# EasyEDA Pro project 赛博沙漏-细砂版（完全开源）.eprj

# Schematic 7219
Create Date: 2023-11-12; Page Name: P1; Project Name: 7219; Schematic Name: 7219; Update Date: 2023-11-12; Company: 嘉立创EDA; Page Size: A4; Version: V1.0
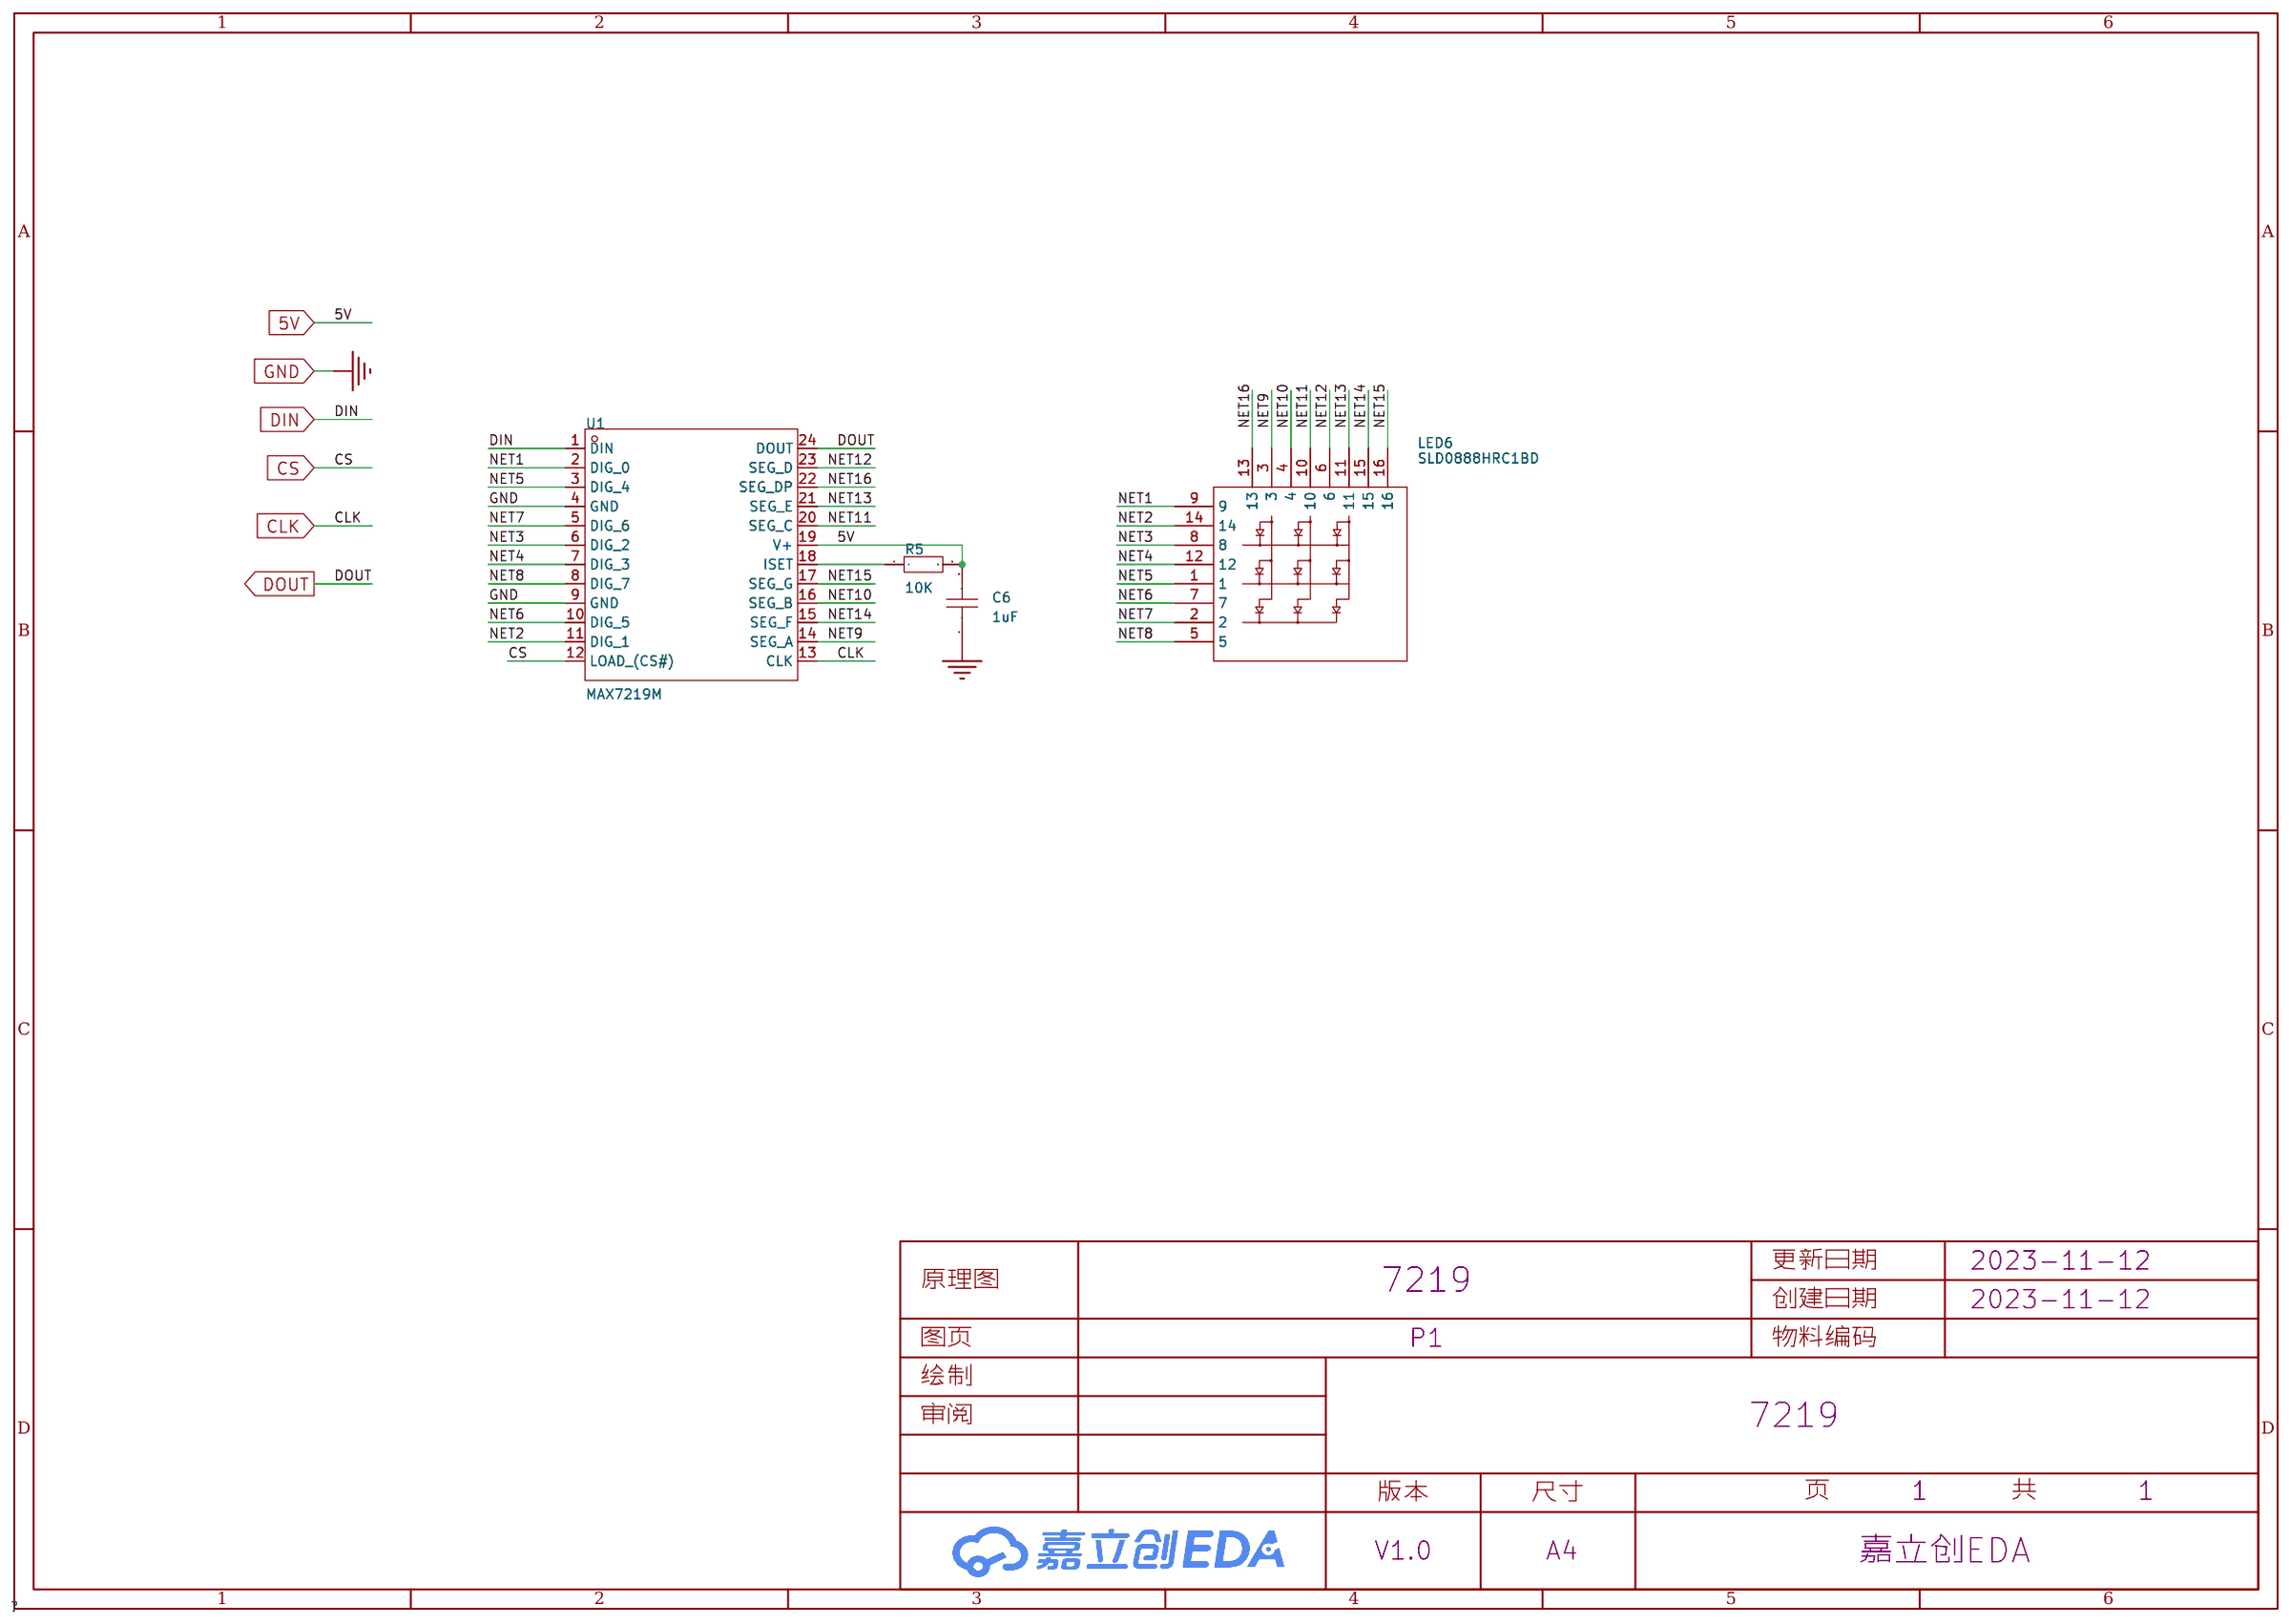
[diagram p0: schematic sheet]

## Parts
C6  1uF  [C0603]
LED6  SLD0888HRC1BD  [LED-SEG-TH_16P-L20.0-W20.0-P2.50-S15.0-BL-1]
R5  10K  [R0603]
U1  MAX7219M  [SOP-24_L15.2-W7.8-P1.27-LS10.6-BL]

## Library data of the parts
C6 = CAP_0603: Supplier Footprint: 0603
LED6 = SLD0888HRC1BD: 位数:8x8;发光颜色:红色;极性:共阴;; LCSC Part Name: 8*8mm,红光,共阴LED点阵数码管,插件; Supplier Part: C225985; Manufacturer: SUNLIGHT(光华); Supplier Footprint: 插件; JLCPCB Part Class: 扩展库; Datasheet: https://atta.szlcsc.com/upload/public/pdf/source/20180608/C225985_43E6E19EA73F5865773790A87A7F1678.pdf; Supplier: LCSC; Dot Matrix Number: 8x8; Emitting Color: 红色; Polarity: 共阴
R5 = Res_0603: Supplier Footprint: 0603
U1 = MAX7219M: Supplier Part: C492110; Manufacturer: HGSEMI(华冠); Supplier Footprint: SOP-24-300mil; JLCPCB Part Class: Extended Part; Datasheet: https://atta.szlcsc.com/upload/public/pdf/source/20200309/C492110_83BE5F1043010F478F6EFCE5853BF374.pdf; Supplier: LCSC

## Nets
5V: C6.2 R5.2 U1.19(V+)
GND: C6.1 U1.4(GND) U1.9(GND)
CLK: U1.13(CLK)
CS: U1.12(LOAD (CS#))
DIN: U1.1(DIN)
DOUT: U1.24(DOUT)
NET1: LED6.9 U1.2(DIG 0)
NET2: LED6.14 U1.11(DIG 1)
NET3: LED6.8 U1.6(DIG 2)
NET4: LED6.12 U1.7(DIG 3)
NET5: LED6.1 U1.3(DIG 4)
NET6: LED6.7 U1.10(DIG 5)
NET7: LED6.2 U1.5(DIG 6)
NET8: LED6.5 U1.8(DIG 7)
NET9: LED6.3 U1.14(SEG A)
NET10: LED6.4 U1.16(SEG B)
NET11: LED6.10 U1.20(SEG C)
NET12: LED6.6 U1.23(SEG D)
NET13: LED6.11 U1.21(SEG E)
NET14: LED6.15 U1.15(SEG F)
NET15: LED6.16 U1.17(SEG G)
NET16: LED6.13 U1.22(SEG DP)
$1N310: R5.1 U1.18(ISET)

# Schematic Schematic1
Create Date: 2023-11-27; Page Name: P1; Project Name: 赛博沙漏-细砂版; Schematic Name: Schematic1; Update Date: 2023-11-27; Company: 嘉立创EDA; Page Size: A4; Version: V1.0
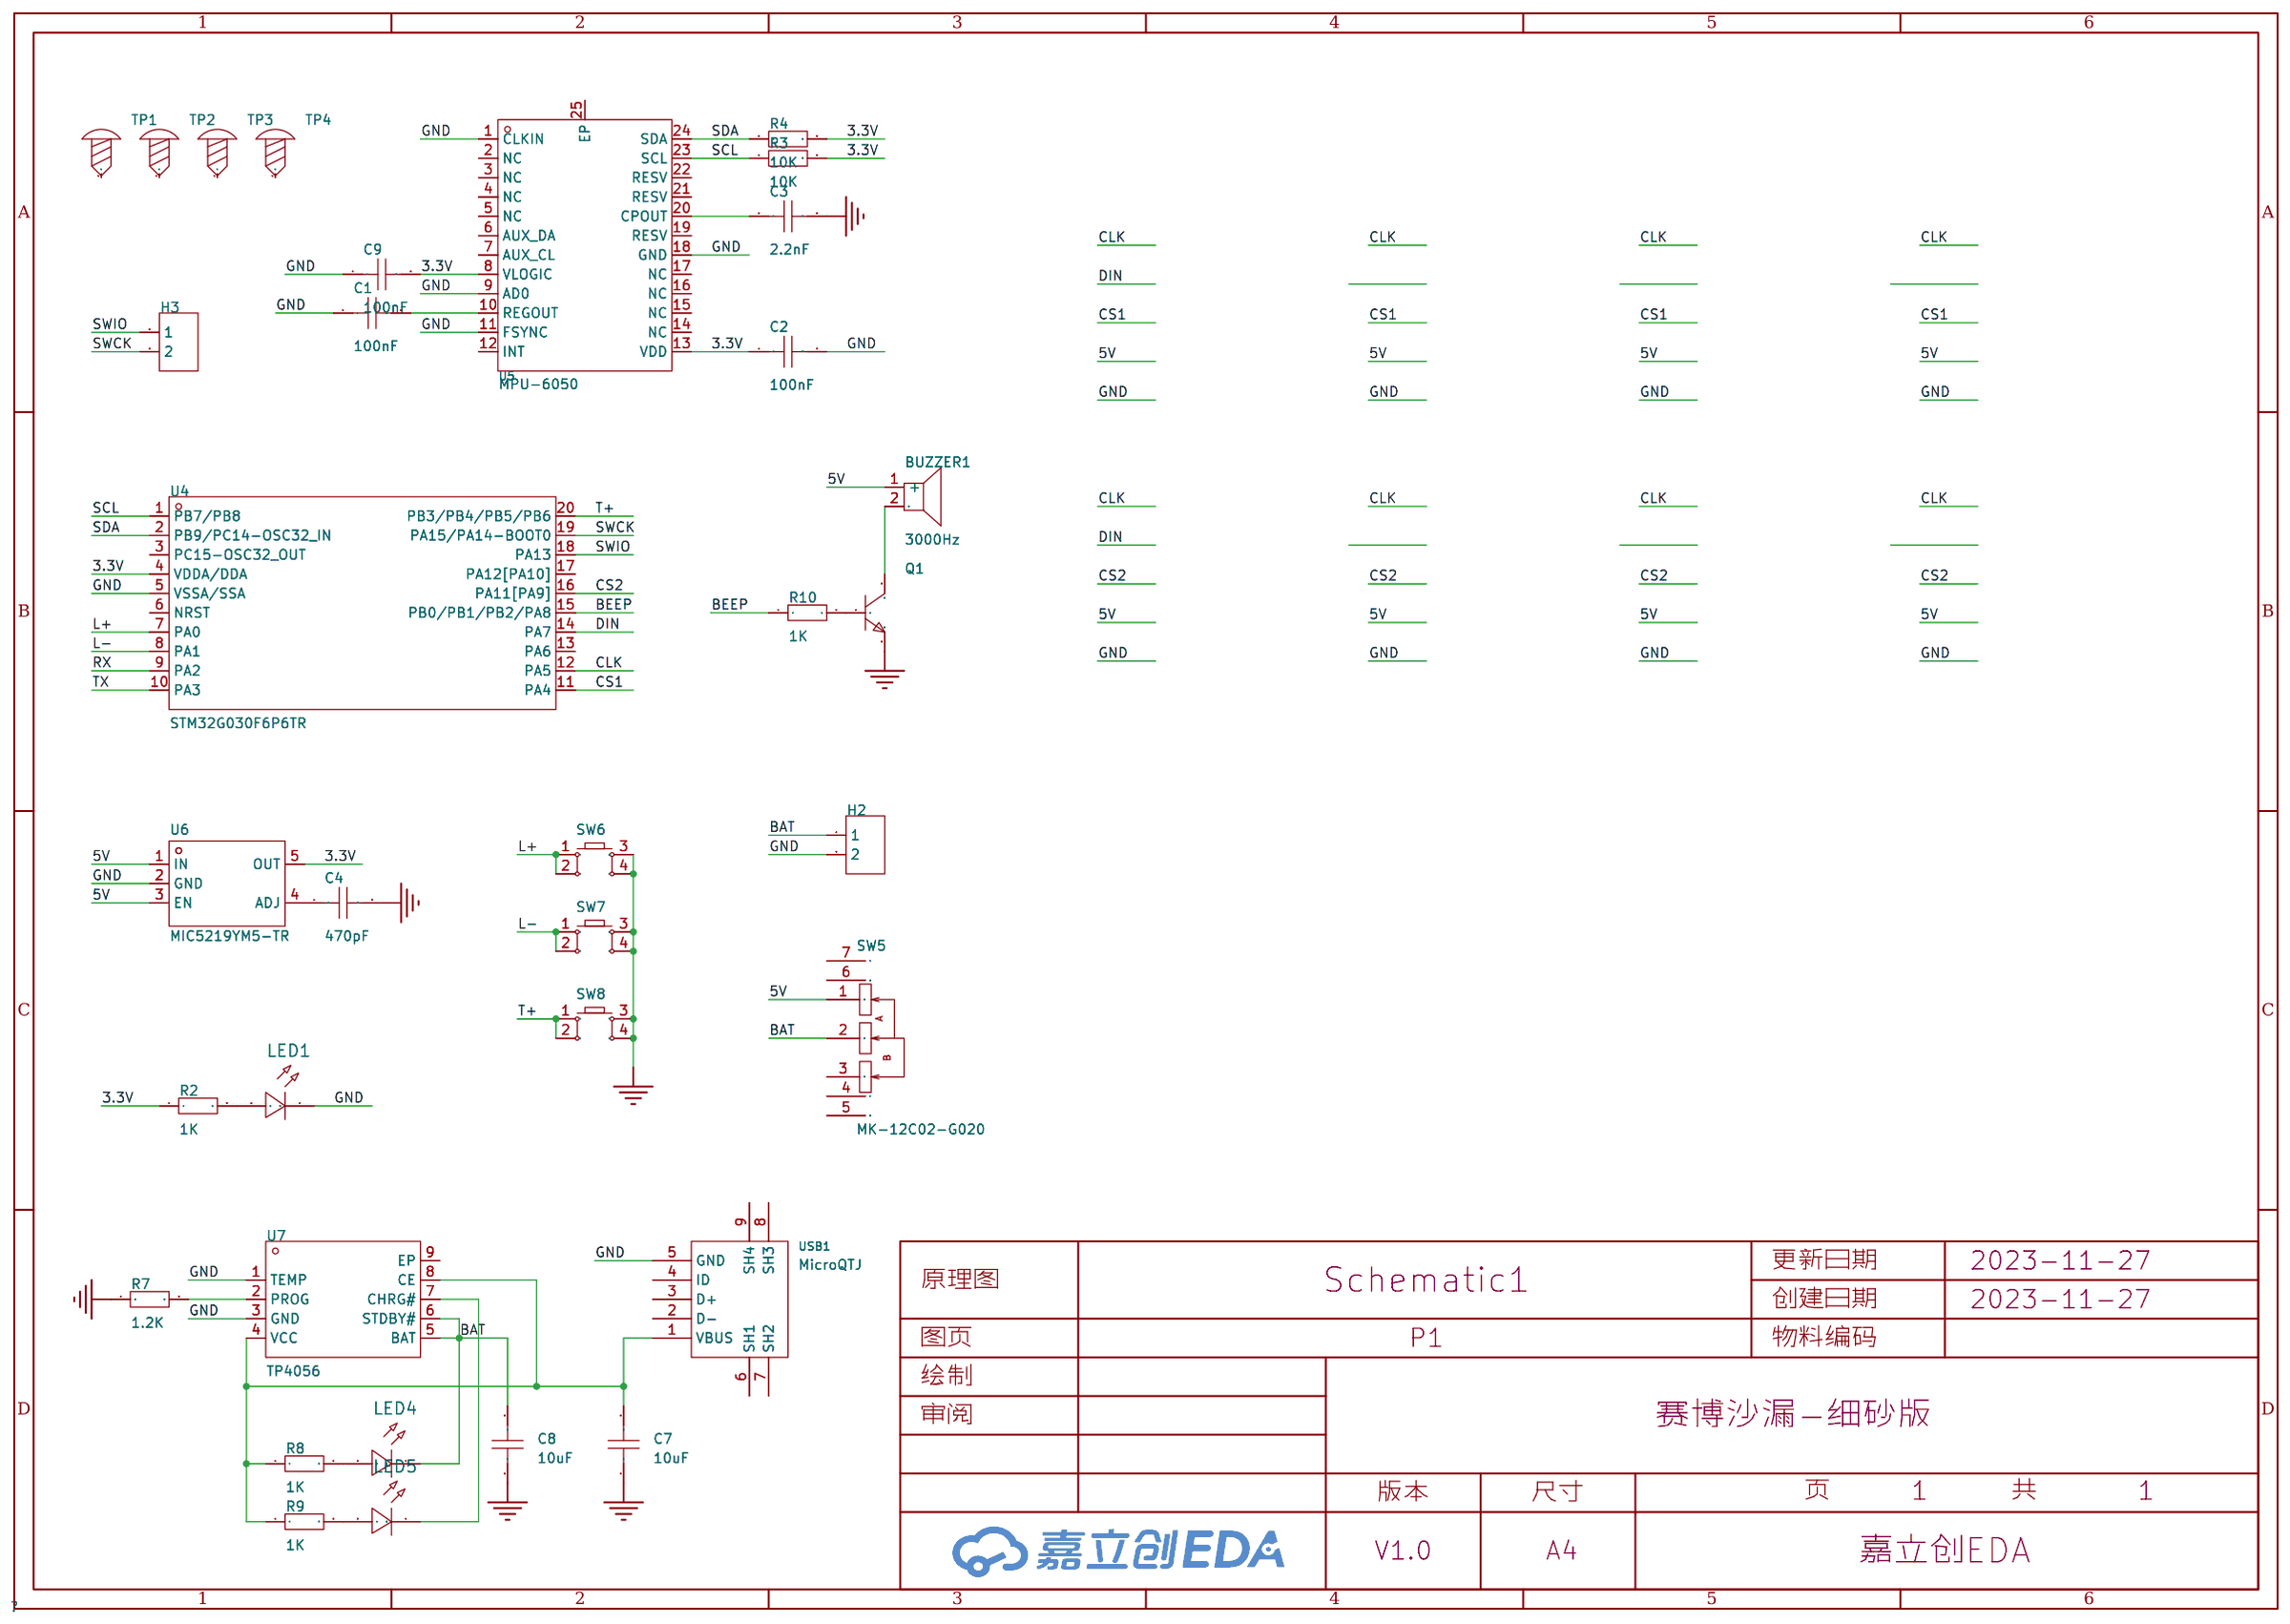
[diagram p1: schematic sheet]

## Parts
BUZZER1  3000Hz  [BUZ-TH_BD9.6-P5.00-D0.7-FD]
C1  100nF  [C0603]
C2  100nF  [C0603]
C3  2.2nF  [C0603]
C4  470pF  [C0603]
C7  10uF  [C0603]
C8  10uF  [C0603]
C9  100nF  [C0603]
CBB1  -
CBB2  -
CBB3  -
CBB4  -
CBB5  -
CBB6  -
CBB7  -
CBB8  -
H2  -  [HDR-TH_2P-P2.54-V-F]
H3  -  [HDR-TH_2P-P2.54-V-F]
LED1  -  [LED_0603]
LED4  -  [LED_0603]
LED5  -  [LED_0603]
Q1  -  [S8050_SOT-23]
R2  1K  [R0603]
R3  10K  [R0603]
R4  10K  [R0603]
R7  1.2K  [R0603]
R8  1K  [R0603]
R9  1K  [R0603]
R10  1K  [R0603]
SW5  MK-12C02-G020  [SW-SMD_MK-12C02-G020]
SW6  -  [SW-SMD_4P-L6.0-W6.0-P4.50-LS9.0-2]
SW7  -  [SW-SMD_4P-L6.0-W6.0-P4.50-LS9.0-2]
SW8  -  [SW-SMD_4P-L6.0-W6.0-P4.50-LS9.0-2]
TP1  -  [M3螺丝]
TP2  -  [M3螺丝]
TP3  -  [M3螺丝]
TP4  -  [M3螺丝]
U4  STM32G030F6P6TR  [TSSOP-20_L6.5-W4.4-P0.65-LS6.4-BL]
U5  MPU-6050  [QFN-24_L4.0-W4.0-P0.50-BL-EP2.7]
U6  MIC5219YM5-TR  [SOT-23-5_L3.0-W1.7-P0.95-LS2.8-TL]
U7  TP4056  [ESOP-8_L4.9-W3.9-P1.27-LS6.0-BL-EP]
USB1  MicroQTJ  [MICRO-USB-SMD_MICROQTJ]

## Library data of the parts
BUZZER1 = HNB09A05: 驱动方式:有源(内含驱动线路);构造类型:电磁式;额定电压:5V;工作电压:4V~8V;频率:3000Hz;声压(SPL):85dB@5V,10cm;直径(φD):9mm;高度:5.7mm;; Supplier Part: C96493; Manufacturer: 华能; Supplier Footprint: 插件; JLCPCB Part Class: 扩展库; Datasheet: https://atta.szlcsc.com/upload/public/pdf/source/20170522/1495448327549.pdf; Supplier: LCSC; Oscillator Circuit: 有源(内含驱动线路); Technology Type: 电磁式; Rated Voltage: 5V; Operating Voltage: 4V~8V; Sound Pressure Level (SPL): 85dB@5V,10cm; Diameter (φD): 9mm; Height: 5.7mm
C1-C4 C7-C9 = CAP_0603: Supplier Footprint: 0603
H2 H3 = HDR-F_2.54_1x2P: Supplier Part: C49661; Supplier Footprint: 插件
LED1 LED4 LED5 = LED_0603-R: Supplier Footprint: 0603
Q1 = S8050_SOT_NPN: Supplier Footprint: SOT-23
R2-R4 R7-R10 = Res_0603: Supplier Footprint: 0603
SW5 = MK-12C02-G020: 七脚小拨动开关G2.0; LCSC Part Name: 微型拨动开关; Supplier Part: C963206; Manufacturer: G-Switch(品赞); Supplier Footprint: SMD,6.7x2.3x1.4mm; JLCPCB Part Class: 扩展库; Datasheet: https://atta.szlcsc.com/upload/public/pdf/source/20200902/C778186_2AF08473ED98414D93A175E8814EEFA6.pdf; Supplier: LCSC
SW6-SW8 = Key_SMD_6x6x6.5: Supplier Footprint: SMD
TP1-TP4 = M3螺丝: Supplier Footprint: 插件
U4 = STM32G030F6P6TR: CPU内核:ARM Cortex-M0;CPU最大主频:64MHz;工作电压范围:2V~3.6V;程序存储容量:32KB;RAM总容量:8KB;EEPROM/数据 FLASH容量:32KB;GPIO端口数量:17;ADC(位数):12bit;DAC(位数):-;(E)PWM(位数):-;外设/功能:DMA；PWM；看门狗;内部振荡器:有;工作温度范围:-40℃~+85℃;; LCSC Part Name: ARM Cortex-M0 64MHz; Supplier Part: C529330; Manufacturer: ST(意法半导体); Supplier Footprint: TSSOP-20; JLCPCB Part Class: Extended Part; Datasheet: https://atta.szlcsc.com/upload/public/pdf/source/20200511/C529329_A1CB615556C746C4EA827FCAD1461480.pdf; Supplier: LCSC; CPU Core: ARM Cortex-M0; CPU Maximum Speed: 64MHz; Operating Voltage Range: 2V~3.6V; Program Storage Size: 32KB; Program Memory Type: FLASH; RAM Size: 8KB; EEPROM: 32KB; GPIO Ports Number: 17; ADC (Bit): 12bit; Peripheral/Function: DMA；PWM；看门狗; Internal Oscillator: 有; Operating Temperature Range: -40℃~+85℃
U5 = MPU-6050: 三轴加速度计和三轴陀螺仪，工作电压：2.375V~3.46V; Supplier Part: C24112; Manufacturer: TDK InvenSense(应美盛); Supplier Footprint: QFN-24(4x4); JLCPCB Part Class: 扩展库; Datasheet: https://atta.szlcsc.com/upload/public/pdf/source/20140425/1457707046159.pdf; Supplier: LCSC
U6 = MIC5219YM5-TR: 输出类型:-;; Supplier Part: C145689; Manufacturer: MICROCHIP(美国微芯); Supplier Footprint: SOT-23-5; JLCPCB Part Class: 扩展库; Datasheet: https://atta.szlcsc.com/upload/public/pdf/source/20171212/C145689_15130637213801177745.pdf; Supplier: LCSC
U7 = TP4056_C725790: Supplier Part: C725790; Manufacturer: UMW(友台半导体); Supplier Footprint: ESOP-8; JLCPCB Part Class: 扩展库; Datasheet: https://atta.szlcsc.com/upload/public/pdf/source/20211011/37515E71BA298E23D23475482C49633D.pdf; Supplier: LCSC
USB1 = MicroQTJ: 连接器类型:Micro-B;标准:USB 2.0;公母:母座;触点数量:5;端口数量:1;安装方式:卧贴;额定电流 - 电源:-;工作温度范围:-30℃~+80℃;; LCSC Part Name: Micro USB 母座 5P 全贴有柱; Supplier Part: C404968; Manufacturer: SHOU HAN(首韩); Supplier Footprint: SMD; JLCPCB Part Class: 扩展库; Supplier: LCSC; Connector Type: Micro-B; Standard: USB 2.0; Gender: 母座; Number of Contacts: 5; Number of Ports: 1; Mounting Style: 卧贴; Operating Temperature Range: -30℃~+80℃

## Nets
3.3V: C2.1 C9.2 R2.1 R3.2 R4.2 U4.4(VDDA/DDA) U5.8(VLOGIC) U5.13(VDD) U6.5(OUT)
5V: BUZZER1.1(+) CBB1.4(5V) CBB2.4(5V) CBB3.4(5V) CBB4.4(5V) CBB5.4(5V) CBB6.4(5V) CBB7.4(5V) CBB8.4(5V) SW5.1 U6.1(IN) U6.3(EN)
GND: C1.1 C2.2 C3.2 C4.2 C7.1 C8.1 C9.1 CBB1.5(GND) CBB2.5(GND) CBB3.5(GND) CBB4.5(GND) CBB5.5(GND) CBB6.5(GND) CBB7.5(GND) CBB8.5(GND) H2.2 LED1.1(C) Q1.2 R7.1 SW6.3 SW6.4 SW7.3 SW7.4 SW8.3 SW8.4 U4.5(VSSA/SSA) U5.1(CLKIN) U5.9(AD0) U5.11(FSYNC) U5.18(GND) U6.2(GND) U7.1(TEMP) U7.3(GND) USB1.5(GND)
BAT: C8.2 H2.1 SW5.2 U7.5(BAT)
BEEP: R10.1 U4.15(PB0/PB1/PB2/PA8)
CLK: CBB1.1(CLK) CBB2.1(CLK) CBB3.1(CLK) CBB4.1(CLK) CBB5.1(CLK) CBB6.1(CLK) CBB7.1(CLK) CBB8.1(CLK) U4.12(PA5)
CS1: CBB1.3(CS) CBB2.3(CS) CBB3.3(CS) CBB4.3(CS) U4.11(PA4)
CS2: CBB5.3(CS) CBB6.3(CS) CBB7.3(CS) CBB8.3(CS) U4.16(PA11[PA9])
DIN: CBB1.2(DIN) CBB5.2(DIN) U4.14(PA7)
L+: SW6.1 SW6.2 U4.7(PA0)
L-: SW7.1 SW7.2 U4.8(PA1)
RX: U4.9(PA2)
SCL: R3.1 U4.1(PB7/PB8) U5.23(SCL)
SDA: R4.1 U4.2(PB9/PC14-OSC32_IN) U5.24(SDA)
SWCK: H3.2 U4.19(PA15/PA14-BOOT0)
SWIO: H3.1 U4.18(PA13)
T+: SW8.1 SW8.2 U4.20(PB3/PB4/PB5/PB6)
TX: U4.10(PA3)
$1N1674: LED1.2(A) R2.2
$1N1867: C1.2 U5.10(REGOUT)
$1N1873: C3.1 U5.20(CPOUT)
$1N1882: C4.1 U6.4(ADJ)
$1N1924: R7.2 U7.2(PROG)
$1N1925: LED4.2(A) R8.2
$1N1926: LED5.2(A) R9.2
$1N1927: LED4.1(C) U7.6(STDBY#)
$1N1928: LED5.1(C) U7.7(CHRG#)
$1N1929: C7.2 R8.1 R9.1 U7.4(VCC) U7.8(CE) USB1.1(VBUS)
$1N1933: Q1.1 R10.2
$1N1934: BUZZER1.2 Q1.3
Net-(CBB1-6): CBB1.6(DOUT) CBB2.2(DIN)
Net-(CBB2-6): CBB2.6(DOUT) CBB3.2(DIN)
Net-(CBB3-6): CBB3.6(DOUT) CBB4.2(DIN)
Net-(CBB5-6): CBB5.6(DOUT) CBB6.2(DIN)
Net-(CBB6-6): CBB6.6(DOUT) CBB7.2(DIN)
Net-(CBB7-6): CBB7.6(DOUT) CBB8.2(DIN)

Not connected (* = marked no-connect by the designer): CBB4 6(DOUT); CBB8 6(DOUT); SW5 3 4 5 6 7; TP1 1; TP2 1; TP3 1; TP4 1; U4 3(PC15-OSC32_OUT) 6(NRST) 13(PA6) 17(PA12[PA10]); U5 2(NC) 3(NC) 4(NC) 5(NC) 6(AUX_DA) 7(AUX_CL) 12(INT) 14(NC) 15(NC) 16(NC) 17(NC) 19(RESV) 21(RESV) 22(RESV) 25(EP); U7 9(EP); USB1 2(D-) 3(D+) 4(ID) 6(SH1) 7(SH2) 8(SH3) 9(SH4)

# Board 7219
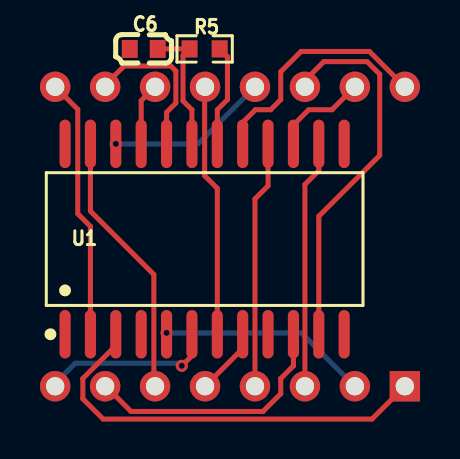
[diagram p2: board, top side]
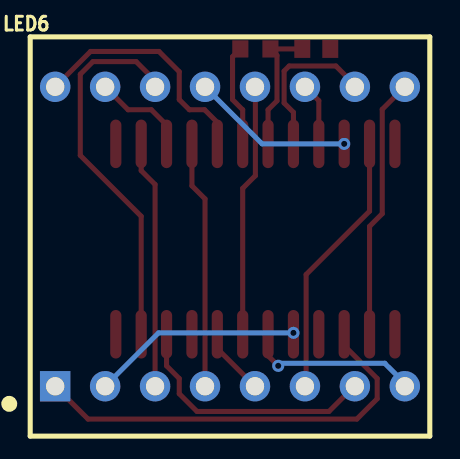
[diagram p3: board, bottom side, seen from below]

No outline. copper layers: Top Layer, Bottom Layer. Coordinates in mm from the lowest, leftmost part position.
Stack: Top Layer 0.035mm / Dielectric1 1.51mm FR4 er 4.5 / Bottom Layer 0.035mm

## Design rules (mm)
template: JLCPCB Capability(Two Layers Board)
spacing copperThickness1oz (default): track to track 0.102, other pairs 0.152 to 0.3
spacing copperThickness2oz: track to track 0.203, other pairs 0.152 to 0.3
track width copperThickness1oz (default): min 0.127, default 0.254, max 2.54
track width copperThickness2oz: min 0.203, default 0.254, max 2.54
differential pair differentialPair (default): width min 0.127, default 0.254, max 2.54; gap min 0.152, default 0.152
via viaSize (default): diameter min 0.5, default 0.61, max 10; hole min 0.3, default 0.305, max 6.3

## Placement (name value [footprint] x y rotation side)
C6  1uF  [C0603]  0 9.52 0 top
LED6  SLD0888HRC1BD  [LED-SEG-TH_16P-L20.0-W20.0-P2.50-S15.0-BL-1]  4.32 0.13 180 bottom
R5  10K  [R0603]  3.05 9.52 180 top
U1  MAX7219M  [SOP-24_L15.2-W7.8-P1.27-LS10.6-BL]  3.05 0 0 top

## Footprints (pads in the part's own frame, mm; a bottom-side part is the same pattern mirrored in y, then rotated)
C0603
  rect 0.8x0.9 smd: 1(-0.7,0) 2(0.7,0)
LED-SEG-TH_16P-L20.0-W20.0-P2.50-S15.0-BL-1
  rect 1.524x1.524 hole 0.914: 1(-8.75,-7.5)
  round 1.524 hole 0.914: 2(-6.25,-7.5) 3(-3.75,-7.5) 4(-1.25,-7.5) 5(1.25,-7.5) 6(3.75,-7.5) 7(6.25,-7.5) 8(8.75,-7.5) 9(8.75,7.5) 10(6.25,7.5) 11(3.75,7.5) 12(1.25,7.5) 13(-1.25,7.5) 14(-3.75,7.5) 15(-6.25,7.5) 16(-8.75,7.5)
R0603
  rect 0.806x0.864 smd: 1(-0.753,0) 2(0.753,0)
SOP-24_L15.2-W7.8-P1.27-LS10.6-BL
  oval 0.56x2.432 smd: 1(-6.985,-4.769) 2(-5.715,-4.769) 3(-4.445,-4.769) 4(-3.175,-4.769) 5(-1.905,-4.769) 6(-0.635,-4.769) 7(0.635,-4.769) 8(1.905,-4.769) 9(3.175,-4.769) 10(4.445,-4.769) 11(5.715,-4.769) 12(6.985,-4.769) 13(6.985,4.769) 14(5.715,4.769) 15(4.445,4.769) 16(3.175,4.769) 17(1.905,4.769) 18(0.635,4.769) 19(-0.635,4.769) 20(-1.905,4.769) 21(-3.175,4.769) 22(-4.445,4.769) 23(-5.715,4.769) 24(-6.985,4.769)

## Nets
As in the schematic.

## Via types
v1: diameter 0.61, hole 0.305, Top Layer to Bottom Layer, 3 vias

## Routing (per net, layer and track width the routed paths; a pad name or vN(x,y) marks a point on that pad's centre or on a via; arc(x,y) is an arc through that point)
5V: length 6.7
  Top Layer w0.254: U1.19 2.41,6.48 1.97,6.92 1.97,9.2 R5.2 C6.2
NET1: length 13.1
  Top Layer w0.254: LED6.9 -3.3,6.5 -3.3,1.27 -2.67,0.63 U1.2
NET2: length 19
  Top Layer w0.254: U1.11 8.76,1.14 11.81,4.19 11.81,8.25 11.18,8.89 9.02,8.89 8.07,7.94 LED6.14
NET3: length 8.7
  Top Layer w0.254: v1(1.91,-6.35) 2.41,-5.84 U1.6
  Bottom Layer w0.254: v1(1.91,-6.35) 1.78,-6.22 -3.43,-6.22 -4.43,-7.23 LED6.8
NET4: length 12.7
  Top Layer w0.254: LED6.12 3.05,7.61 3.05,3.17 3.68,2.54 U1.7
NET5: length 21.1
  Top Layer w0.254: LED6.1 11.42,-9.02 -2.03,-9.02 -3.05,-8 -3.05,-6.98 -1.4,-5.33 U1.3
NET6: length 12.9
  Top Layer w0.254: LED6.7 -1.9,-7.37 -0.63,-8.64 5.97,-8.64 6.86,-7.75 6.86,-6.98 7.49,-6.35 7.49,-4.77
NET7: length 10.6
  Top Layer w0.254: v1(1.14,-4.7) U1.5
  Bottom Layer w0.254: v1(1.14,-4.7) 7.89,-4.7 LED6.2
NET8: length 3.4
  Top Layer w0.254: U1.8 4.95,-5.49 LED6.5
NET9: length 12.4
  Top Layer w0.254: U1.14 8.76,3.43 8.07,2.73 LED6.3
NET10: length 12.4
  Top Layer w0.254: LED6.4 5.57,2.01 6.22,2.67 U1.16
NET11: length 8
  Top Layer w0.254: LED6.10 -1.93,7.72 -0.98,8.67 1.36,8.67 1.61,8.41 1.61,6.82 1.14,6.35 U1.20
NET12: length 13.5
  Top Layer w0.254: LED6.6 0.51,-7.31 0.51,-1.78 -2.67,1.4 U1.23
NET13: length 3.1
  Top Layer w0.254: LED6.11 -0.13,6.93 -0.13,4.77
NET14: length 4.8
  Top Layer w0.254: LED6.15 9.42,6.48 8.26,6.48 7.49,5.71 7.49,4.77
NET15: length 12.2
  Top Layer w0.254: LED6.16 11.3,9.4 7.87,9.4 6.86,8.38 6.86,6.98 6.35,6.48 5.59,6.48 4.95,5.84 U1.17
NET16: length 8.1
  Bottom Layer w0.254: LED6.13 2.71,4.77 v1(-1.4,4.77)
$1N310: length 5.1
  Top Layer w0.254: R5.1 4.19,9.14 4.19,6.98 3.68,6.48 U1.18

# Board PCB1
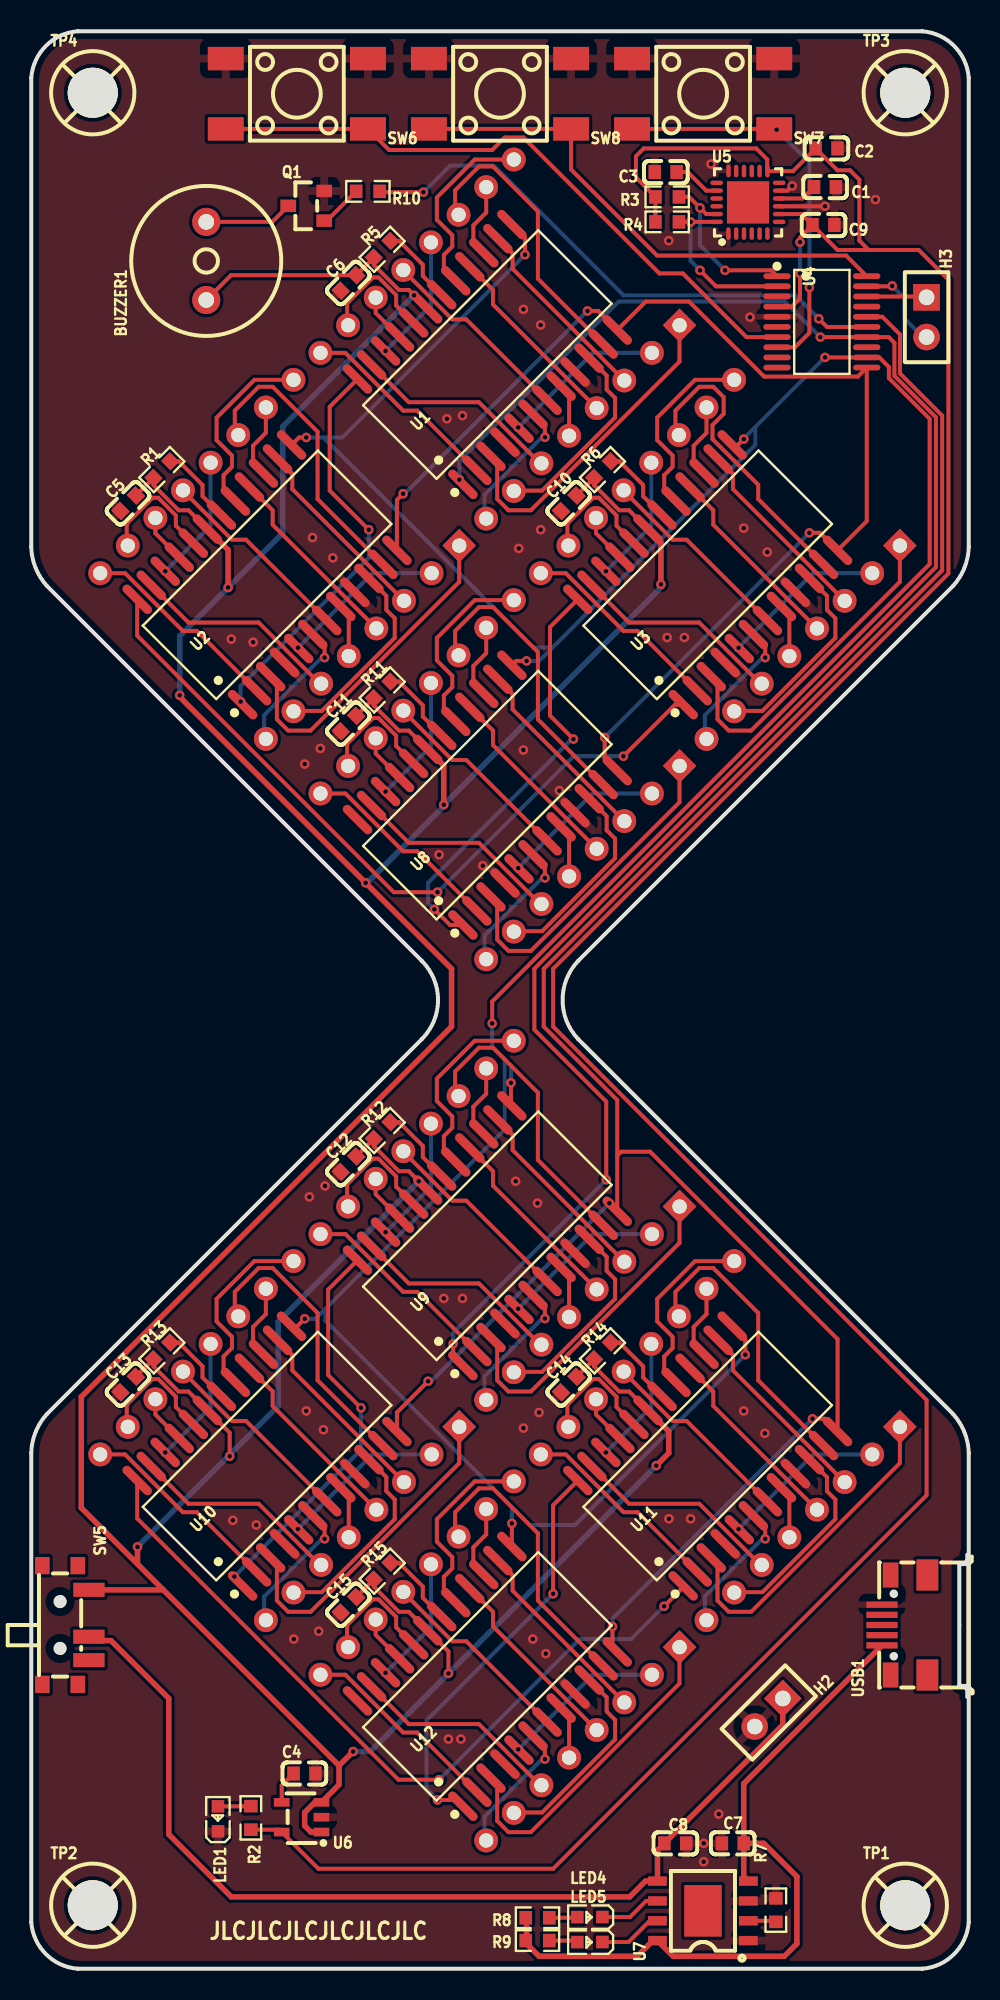
[diagram p4: board, top side]
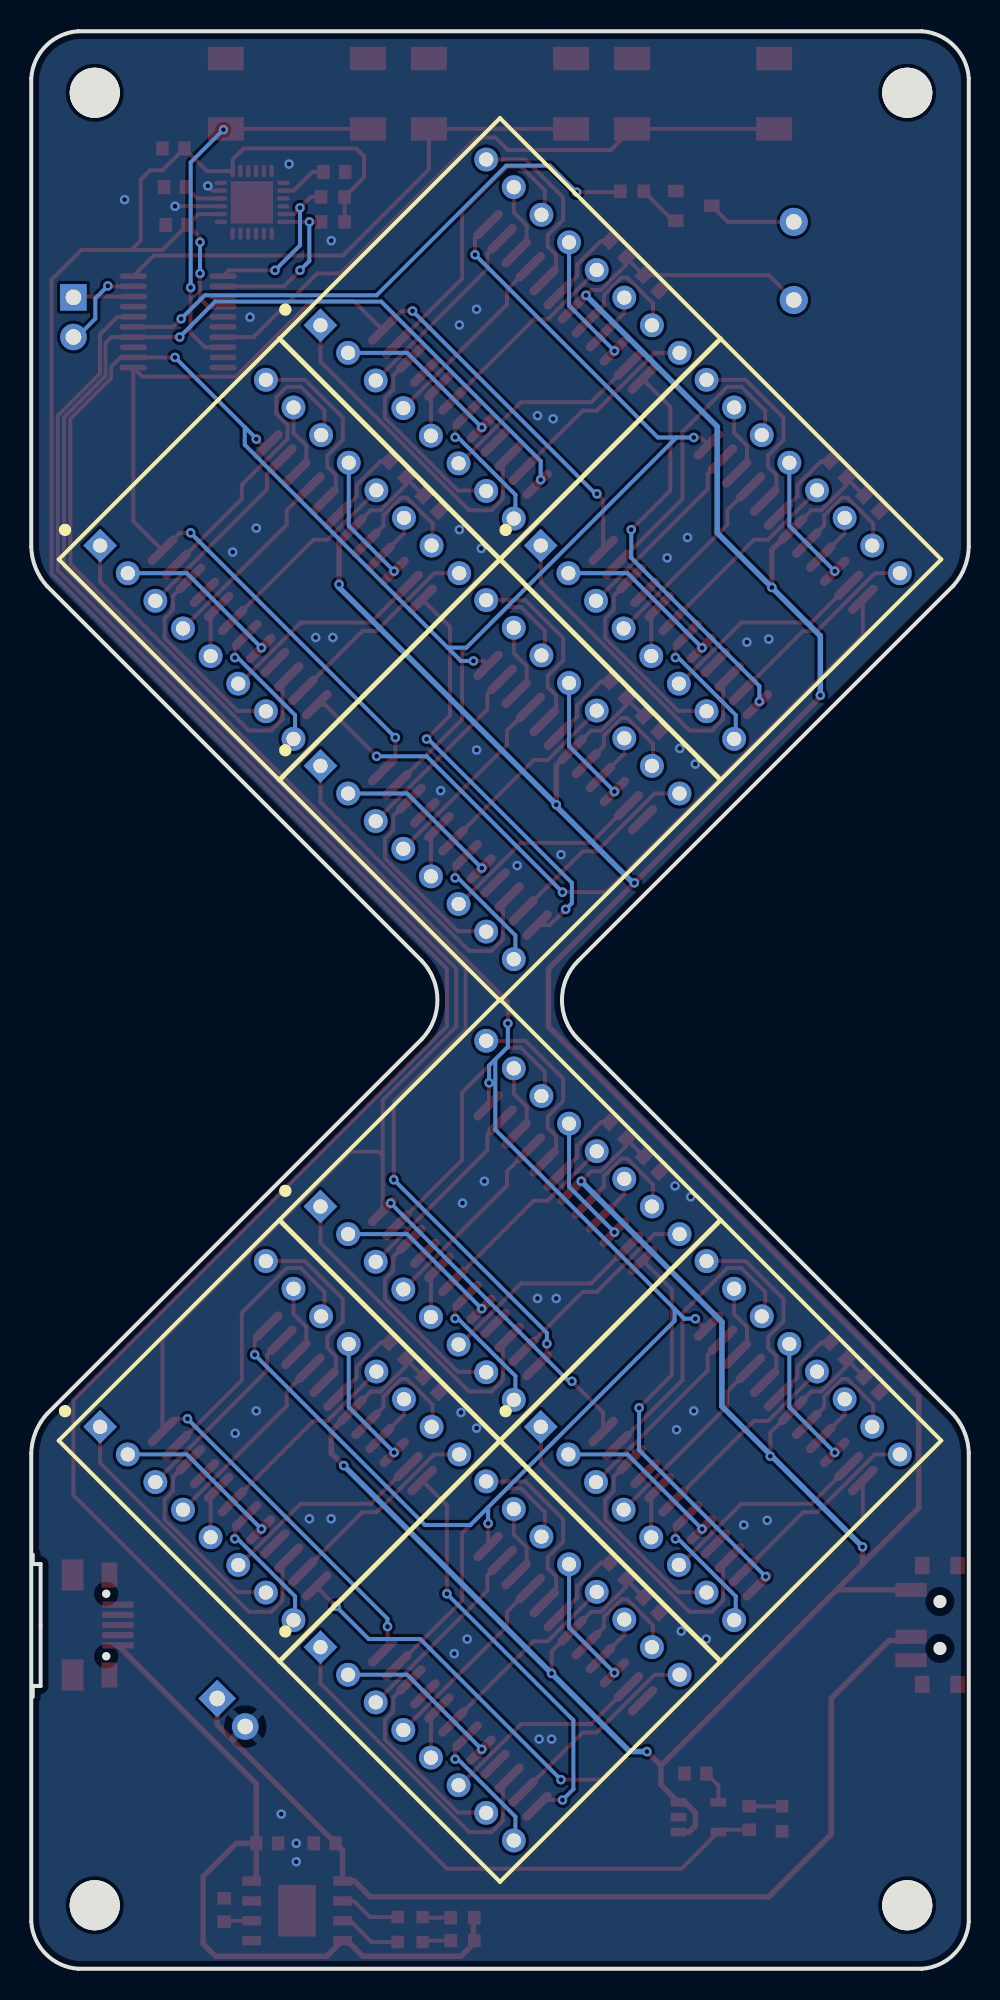
[diagram p5: board, bottom side, seen from below]

Outline 60 x 124 mm; copper layers: Top Layer, Bottom Layer. Coordinates in mm from the lower left corner of the outline.
Outline path: 0,121 0,91 arc(0.28,89.66) 1,88.5 25,64.5 arc(26.04,62) 25,59.5 1,35.5 arc(0.28,34.34) 0,33 0,3 arc(0.94,0.94) 3,0 57,0 arc(59.06,0.94) 60,3 60,33 arc(59.72,34.34) 59,35.5 35,59.5 arc(34.01,62) 35,64.5 59,88.5 arc(59.72,89.66) 60,91 60,121 arc(59.06,123.06) 57,124 3,124 arc(0.94,123.06) 0,121
Stack: Top Layer 0.035mm / Dielectric1 1.51mm FR4 er 4.5 / Bottom Layer 0.035mm

## Design rules (mm)
template: JLCPCB Capability(Two Layers Board)
spacing copperThickness1oz (default): track to track 0.102, other pairs 0.152 to 0.3
spacing copperThickness2oz: track to track 0.203, other pairs 0.152 to 0.3
track width copperThickness1oz (default): min 0.127, default 0.254, max 2.54
track width copperThickness2oz: min 0.203, default 0.254, max 2.54
differential pair differentialPair (default): width min 0.127, default 0.254, max 2.54; gap min 0.152, default 0.152
via viaSize (default): diameter min 0.5, default 0.61, max 10; hole min 0.3, default 0.305, max 6.3

## Placement (name value [footprint] x y rotation side)
BUZZER1  3000Hz  [BUZ-TH_BD9.6-P5.00-D0.7-FD]  11.2 109.3 90 top
C1  100nF  [C0603]  50.8 114.03 180 top
C2  100nF  [C0603]  50.9 116.5 0 top
C3  2.2nF  [C0603]  40.6 114.99 180 top
C4  470pF  [C0603]  17.49 12.5 0 top
C5  1uF  [C0603]  6.2 93.79 45 top
C6  1uF  [C0603]  20.3 107.89 45 top
C7  10uF  [C0603]  44.9 8.03 0 top
C8  10uF  [C0603]  41.22 8.03 180 top
C9  100nF  [C0603]  50.7 111.6 180 top
C10  1uF  [C0603]  34.4 93.79 45 top
C11  1uF  [C0603]  20.3 79.69 45 top
C12  1uF  [C0603]  20.3 51.49 45 top
C13  1uF  [C0603]  6.2 37.39 45 top
C14  1uF  [C0603]  34.4 37.39 45 top
C15  1uF  [C0603]  20.3 23.29 45 top
H2  -  [HDR-TH_2P-P2.54-V-F]  47.2 16.4 225 top
H3  -  [HDR-TH_2P-P2.54-V-F]  57.3 105.7 270 top
LED1  -  [LED_0603]  11.94 9.65 90 top
LED4  -  [LED_0603]  35.7 3.3 180 top
LED5  -  [LED_0603]  35.7 1.7 180 top
NOREF  -  [LED-SEG-TH_16P-L20.0-W20.0-P2.50-S15.0-BL-1]  30 104.3 225 bottom
NOREF#2  -  [LED-SEG-TH_16P-L20.0-W20.0-P2.50-S15.0-BL-1]  15.9 90.2 225 bottom
NOREF#3  -  [LED-SEG-TH_16P-L20.0-W20.0-P2.50-S15.0-BL-1]  44.1 90.2 225 bottom
NOREF#4  -  [LED-SEG-TH_16P-L20.0-W20.0-P2.50-S15.0-BL-1]  30 76.1 225 bottom
NOREF#5  -  [LED-SEG-TH_16P-L20.0-W20.0-P2.50-S15.0-BL-1]  30 47.9 225 bottom
NOREF#6  -  [LED-SEG-TH_16P-L20.0-W20.0-P2.50-S15.0-BL-1]  15.9 33.8 225 bottom
NOREF#7  -  [LED-SEG-TH_16P-L20.0-W20.0-P2.50-S15.0-BL-1]  44.1 33.8 225 bottom
NOREF#8  -  [LED-SEG-TH_16P-L20.0-W20.0-P2.50-S15.0-BL-1]  30 19.7 225 bottom
Q1  -  [S8050_SOT-23]  17.6 112.7 0 top
R1  10K  [R0603]  8.36 95.95 225 top
R2  1K  [R0603]  14.05 9.65 90 top
R3  10K  [R0603]  40.7 113.4 180 top
R4  10K  [R0603]  40.7 111.8 180 top
R5  10K  [R0603]  22.46 110.05 225 top
R6  10K  [R0603]  36.56 95.95 225 top
R7  1.2K  [R0603]  47.65 3.75 270 top
R8  1K  [R0603]  32.4 3.26 0 top
R9  1K  [R0603]  32.4 1.8 0 top
R10  1K  [R0603]  21.55 113.75 180 top
R11  10K  [R0603]  22.46 81.85 225 top
R12  10K  [R0603]  22.46 53.65 225 top
R13  10K  [R0603]  8.36 39.55 225 top
R14  10K  [R0603]  36.56 39.55 225 top
R15  10K  [R0603]  22.46 25.45 225 top
SW5  MK-12C02-G020  [SW-SMD_MK-12C02-G020]  2.2 22 270 top
SW6  -  [SW-SMD_4P-L6.0-W6.0-P4.50-LS9.0-2]  17 120 180 top
SW7  -  [SW-SMD_4P-L6.0-W6.0-P4.50-LS9.0-2]  43 120 180 top
SW8  -  [SW-SMD_4P-L6.0-W6.0-P4.50-LS9.0-2]  30 120 180 top
TP1  -  [M3螺丝]  56 4 0 top
TP2  -  [M3螺丝]  4 4 0 top
TP3  -  [M3螺丝]  56 120 0 top
TP4  -  [M3螺丝]  4 120 0 top
U1  MAX7219M  [SOP-24_L15.2-W7.8-P1.27-LS10.6-BL]  29.19 103.31 45 top
U2  MAX7219M  [SOP-24_L15.2-W7.8-P1.27-LS10.6-BL]  15.09 89.21 45 top
U3  MAX7219M  [SOP-24_L15.2-W7.8-P1.27-LS10.6-BL]  43.29 89.21 45 top
U4  STM32G030F6P6TR  [TSSOP-20_L6.5-W4.4-P0.65-LS6.4-BL]  50.6 105.4 270 top
U5  MPU-6050  [QFN-24_L4.0-W4.0-P0.50-BL-EP2.7]  45.87 113.05 0 top
U6  MIC5219YM5-TR  [SOT-23-5_L3.0-W1.7-P0.95-LS2.8-TL]  17.3 9.7 180 top
U7  TP4056  [ESOP-8_L4.9-W3.9-P1.27-LS6.0-BL-EP]  42.99 3.71 90 top
U8  MAX7219M  [SOP-24_L15.2-W7.8-P1.27-LS10.6-BL]  29.19 75.11 45 top
U9  MAX7219M  [SOP-24_L15.2-W7.8-P1.27-LS10.6-BL]  29.19 46.91 45 top
U10  MAX7219M  [SOP-24_L15.2-W7.8-P1.27-LS10.6-BL]  15.09 32.81 45 top
U11  MAX7219M  [SOP-24_L15.2-W7.8-P1.27-LS10.6-BL]  43.29 32.81 45 top
U12  MAX7219M  [SOP-24_L15.2-W7.8-P1.27-LS10.6-BL]  29.19 18.71 45 top
USB1  MicroQTJ  [MICRO-USB-SMD_MICROQTJ]  55.9 22 90 top

## Footprints (pads in the part's own frame, mm; a bottom-side part is the same pattern mirrored in y, then rotated)
BUZ-TH_BD9.6-P5.00-D0.7-FD
  round 1.8 hole 1: 1(-2.5,0) 2(2.5,0)
C0603
  rect 0.8x0.9 smd: 1(-0.7,0) 2(0.7,0)
ESOP-8_L4.9-W3.9-P1.27-LS6.0-BL-EP
  rect 0.6x1.2 smd: 1(-1.905,-2.909) 2(-0.635,-2.909) 3(0.635,-2.909) 4(1.905,-2.909) 5(1.905,2.909) 6(0.635,2.909) 7(-0.635,2.909) 8(-1.905,2.909)
  rect 3.3x2.4 smd: 9(0,0)
HDR-TH_2P-P2.54-V-F
  rect 1.7x1.7 hole 1: 1(-1.27,0)
  round 1.7 hole 1: 2(1.27,0)
LED-SEG-TH_16P-L20.0-W20.0-P2.50-S15.0-BL-1
  rect 1.524x1.524 hole 0.914: 1(-8.75,-7.5)
  round 1.524 hole 0.914: 2(-6.25,-7.5) 3(-3.75,-7.5) 4(-1.25,-7.5) 5(1.25,-7.5) 6(3.75,-7.5) 7(6.25,-7.5) 8(8.75,-7.5) 9(8.75,7.5) 10(6.25,7.5) 11(3.75,7.5) 12(1.25,7.5) 13(-1.25,7.5) 14(-3.75,7.5) 15(-6.25,7.5) 16(-8.75,7.5)
LED_0603
  rect 0.8x0.8 smd: 1(-0.851,-0.01) 2(0.75,-0.005)
M3螺丝
  round 3.2 hole 3.2: 1(-0.064,0.064)
MICRO-USB-SMD_MICROQTJ
  rect 0.4x2 smd: 1(-1.3,1.452) 2(-0.65,1.452) 3(0,1.452) 4(0.65,1.452) 5(1.3,1.452)
  rect 1.6x1 smd: 6(-3.2,0.901) 9(3.2,0.901)
  rect 2x1.4 smd: 7(-3.2,-1.452) 8(3.2,-1.452)
QFN-24_L4.0-W4.0-P0.50-BL-EP2.7
  oval 0.28x0.8 smd: 1(-1.25,-2) 2(-0.75,-2) 3(-0.25,-2) 4(0.25,-2) 5(0.75,-2) 6(1.25,-2) 13(1.25,2) 14(0.75,2) 15(0.25,2) 16(-0.25,2) 17(-0.75,2) 18(-1.242,2)
  oval 0.8x0.28 smd: 7(2,-1.25) 8(2,-0.75) 9(2,-0.25) 10(2,0.25) 11(2,0.75) 12(2,1.25) 19(-2,1.25) 20(-2,0.75) 21(-2,0.25) 22(-2,-0.25) 23(-2,-0.75) 24(-2,-1.25)
  rect 2.7x2.7 smd: 25(0.013,0)
R0603
  rect 0.806x0.864 smd: 1(-0.753,0) 2(0.753,0)
S8050_SOT-23
  rect 1x0.8 smd: 1(1.15,-0.823) 2(1.15,1.077) 3(-1.15,0.127)
SOP-24_L15.2-W7.8-P1.27-LS10.6-BL
  oval 0.56x2.432 smd: 1(-6.985,-4.769) 2(-5.715,-4.769) 3(-4.445,-4.769) 4(-3.175,-4.769) 5(-1.905,-4.769) 6(-0.635,-4.769) 7(0.635,-4.769) 8(1.905,-4.769) 9(3.175,-4.769) 10(4.445,-4.769) 11(5.715,-4.769) 12(6.985,-4.769) 13(6.985,4.769) 14(5.715,4.769) 15(4.445,4.769) 16(3.175,4.769) 17(1.905,4.769) 18(0.635,4.769) 19(-0.635,4.769) 20(-1.905,4.769) 21(-3.175,4.769) 22(-4.445,4.769) 23(-5.715,4.769) 24(-6.985,4.769)
SOT-23-5_L3.0-W1.7-P0.95-LS2.8-TL
  rect 1x0.55 smd: 1(-1.272,0.95) 2(-1.272,0) 3(-1.272,-0.95) 4(1.272,-0.95) 5(1.272,0.95)
SW-SMD_4P-L6.0-W6.0-P4.50-LS9.0-2
  rect 2.3x1.5 smd: 1(-4.55,2.25) 2(4.55,2.25) 3(-4.55,-2.25) 4(4.55,-2.25)
SW-SMD_MK-12C02-G020
  rect 0.9x2 smd: 1(-2.25,1.49) 2(0.75,1.49) 3(2.25,1.49)
  rect 1.1x0.93 smd: 4(3.8,0.779) 5(3.8,-1.49) 6(-3.8,-1.49) 7(-3.8,0.779)
TSSOP-20_L6.5-W4.4-P0.65-LS6.4-BL
  oval 0.364x1.742 smd: 1(-2.925,-2.871) 2(-2.275,-2.871) 3(-1.625,-2.871) 4(-0.975,-2.871) 5(-0.325,-2.871) 6(0.325,-2.871) 7(0.975,-2.871) 8(1.625,-2.871) 9(2.275,-2.871) 10(2.925,-2.871) 11(2.925,2.871) 12(2.275,2.871) 13(1.625,2.871) 14(0.975,2.871) 15(0.325,2.871) 16(-0.325,2.871) 17(-0.975,2.871) 18(-1.625,2.871) 19(-2.275,2.871) 20(-2.925,2.871)

## Nets
3.3V: C2.1 C9.2 R2.1 R3.2 R4.2 U4.4 U5.8 U5.13 U6.5
5V: BUZZER1.1 C5.2 C6.2 C10.2 C11.2 C12.2 C13.2 C14.2 C15.2 R1.2 R5.2 R6.2 R11.2 R12.2 R13.2 R14.2 R15.2 SW5.1 U1.19 U2.19 U3.19 U6.1 U6.3 U8.19 U9.19 U10.19 U11.19 U12.19
GND: C1.1 C2.2 C3.2 C4.2 C5.1 C6.1 C7.1 C8.1 C9.1 C10.1 C11.1 C12.1 C13.1 C14.1 C15.1 H2.2 LED1.1 Q1.2 R7.1 SW6.3 SW6.4 SW7.3 SW7.4 SW8.3 SW8.4 U1.4 U1.9 U2.4 U2.9 U3.4 U3.9 U4.5 U5.1 U5.9 U5.11 U5.18 U6.2 U7.1 U7.3 U8.4 U8.9 U9.4 U9.9 U10.4 U10.9 U11.4 U11.9 U12.4 U12.9 USB1.5
$1I4906/NET1: NOREF.9 U1.2
$1I4906/NET2: NOREF.14 U1.11
$1I4906/NET3: NOREF.8 U1.6
$1I4906/NET4: NOREF.12 U1.7
$1I4906/NET5: NOREF.1 U1.3
$1I4906/NET6: NOREF.7 U1.10
$1I4906/NET7: NOREF.2 U1.5
$1I4906/NET8: NOREF.5 U1.8
$1I4906/NET9: NOREF.3 U1.14
$1I4906/NET10: NOREF.4 U1.16
$1I4906/NET11: NOREF.10 U1.20
$1I4906/NET12: NOREF.6 U1.23
$1I4906/NET13: NOREF.11 U1.21
$1I4906/NET14: NOREF.15 U1.15
$1I4906/NET15: NOREF.16 U1.17
$1I4906/NET16: NOREF.13 U1.22
$1I4930/NET1: NOREF#2.9 U2.2
$1I4930/NET2: NOREF#2.14 U2.11
$1I4930/NET3: NOREF#2.8 U2.6
$1I4930/NET4: NOREF#2.12 U2.7
$1I4930/NET5: NOREF#2.1 U2.3
$1I4930/NET6: NOREF#2.7 U2.10
$1I4930/NET7: NOREF#2.2 U2.5
$1I4930/NET8: NOREF#2.5 U2.8
$1I4930/NET9: NOREF#2.3 U2.14
$1I4930/NET10: NOREF#2.4 U2.16
$1I4930/NET11: NOREF#2.10 U2.20
$1I4930/NET12: NOREF#2.6 U2.23
$1I4930/NET13: NOREF#2.11 U2.21
$1I4930/NET14: NOREF#2.15 U2.15
$1I4930/NET15: NOREF#2.16 U2.17
$1I4930/NET16: NOREF#2.13 U2.22
$1I4954/NET1: NOREF#3.9 U3.2
$1I4954/NET2: NOREF#3.14 U3.11
$1I4954/NET3: NOREF#3.8 U3.6
$1I4954/NET4: NOREF#3.12 U3.7
$1I4954/NET5: NOREF#3.1 U3.3
$1I4954/NET6: NOREF#3.7 U3.10
$1I4954/NET7: NOREF#3.2 U3.5
$1I4954/NET8: NOREF#3.5 U3.8
$1I4954/NET9: NOREF#3.3 U3.14
$1I4954/NET10: NOREF#3.4 U3.16
$1I4954/NET11: NOREF#3.10 U3.20
$1I4954/NET12: NOREF#3.6 U3.23
$1I4954/NET13: NOREF#3.11 U3.21
$1I4954/NET14: NOREF#3.15 U3.15
$1I4954/NET15: NOREF#3.16 U3.17
$1I4954/NET16: NOREF#3.13 U3.22
$1I4978/DOUT: U8.24
$1I4978/NET1: NOREF#4.9 U8.2
$1I4978/NET2: NOREF#4.14 U8.11
$1I4978/NET3: NOREF#4.8 U8.6
$1I4978/NET4: NOREF#4.12 U8.7
$1I4978/NET5: NOREF#4.1 U8.3
$1I4978/NET6: NOREF#4.7 U8.10
$1I4978/NET7: NOREF#4.2 U8.5
$1I4978/NET8: NOREF#4.5 U8.8
$1I4978/NET9: NOREF#4.3 U8.14
$1I4978/NET10: NOREF#4.4 U8.16
$1I4978/NET11: NOREF#4.10 U8.20
$1I4978/NET12: NOREF#4.6 U8.23
$1I4978/NET13: NOREF#4.11 U8.21
$1I4978/NET14: NOREF#4.15 U8.15
$1I4978/NET15: NOREF#4.16 U8.17
$1I4978/NET16: NOREF#4.13 U8.22
$1I5079/NET1: NOREF#5.9 U9.2
$1I5079/NET2: NOREF#5.14 U9.11
$1I5079/NET3: NOREF#5.8 U9.6
$1I5079/NET4: NOREF#5.12 U9.7
$1I5079/NET5: NOREF#5.1 U9.3
$1I5079/NET6: NOREF#5.7 U9.10
$1I5079/NET7: NOREF#5.2 U9.5
$1I5079/NET8: NOREF#5.5 U9.8
$1I5079/NET9: NOREF#5.3 U9.14
$1I5079/NET10: NOREF#5.4 U9.16
$1I5079/NET11: NOREF#5.10 U9.20
$1I5079/NET12: NOREF#5.6 U9.23
$1I5079/NET13: NOREF#5.11 U9.21
$1I5079/NET14: NOREF#5.15 U9.15
$1I5079/NET15: NOREF#5.16 U9.17
$1I5079/NET16: NOREF#5.13 U9.22
$1I5103/NET1: NOREF#6.9 U10.2
$1I5103/NET2: NOREF#6.14 U10.11
$1I5103/NET3: NOREF#6.8 U10.6
$1I5103/NET4: NOREF#6.12 U10.7
$1I5103/NET5: NOREF#6.1 U10.3
$1I5103/NET6: NOREF#6.7 U10.10
$1I5103/NET7: NOREF#6.2 U10.5
$1I5103/NET8: NOREF#6.5 U10.8
$1I5103/NET9: NOREF#6.3 U10.14
$1I5103/NET10: NOREF#6.4 U10.16
$1I5103/NET11: NOREF#6.10 U10.20
$1I5103/NET12: NOREF#6.6 U10.23
$1I5103/NET13: NOREF#6.11 U10.21
$1I5103/NET14: NOREF#6.15 U10.15
$1I5103/NET15: NOREF#6.16 U10.17
$1I5103/NET16: NOREF#6.13 U10.22
$1I5127/NET1: NOREF#7.9 U11.2
$1I5127/NET2: NOREF#7.14 U11.11
$1I5127/NET3: NOREF#7.8 U11.6
$1I5127/NET4: NOREF#7.12 U11.7
$1I5127/NET5: NOREF#7.1 U11.3
$1I5127/NET6: NOREF#7.7 U11.10
$1I5127/NET7: NOREF#7.2 U11.5
$1I5127/NET8: NOREF#7.5 U11.8
$1I5127/NET9: NOREF#7.3 U11.14
$1I5127/NET10: NOREF#7.4 U11.16
$1I5127/NET11: NOREF#7.10 U11.20
$1I5127/NET12: NOREF#7.6 U11.23
$1I5127/NET13: NOREF#7.11 U11.21
$1I5127/NET14: NOREF#7.15 U11.15
$1I5127/NET15: NOREF#7.16 U11.17
$1I5127/NET16: NOREF#7.13 U11.22
$1I5151/DOUT: U12.24
$1I5151/NET1: NOREF#8.9 U12.2
$1I5151/NET2: NOREF#8.14 U12.11
$1I5151/NET3: NOREF#8.8 U12.6
$1I5151/NET4: NOREF#8.12 U12.7
$1I5151/NET5: NOREF#8.1 U12.3
$1I5151/NET6: NOREF#8.7 U12.10
$1I5151/NET7: NOREF#8.2 U12.5
$1I5151/NET8: NOREF#8.5 U12.8
$1I5151/NET9: NOREF#8.3 U12.14
$1I5151/NET10: NOREF#8.4 U12.16
$1I5151/NET11: NOREF#8.10 U12.20
$1I5151/NET12: NOREF#8.6 U12.23
$1I5151/NET13: NOREF#8.11 U12.21
$1I5151/NET14: NOREF#8.15 U12.15
$1I5151/NET15: NOREF#8.16 U12.17
$1I5151/NET16: NOREF#8.13 U12.22
BAT: C8.2 H2.1 SW5.2 U7.5
BEEP: R10.1 U4.15
CLK: U1.13 U2.13 U3.13 U4.12 U8.13 U9.13 U10.13 U11.13 U12.13
CS1: U1.12 U2.12 U3.12 U4.11 U8.12
CS2: U4.16 U9.12 U10.12 U11.12 U12.12
DIN: U1.1 U4.14 U9.1
L+: SW6.1 SW6.2 U4.7
L-: SW7.1 SW7.2 U4.8
RX: U4.9
SCL: R3.1 U4.1 U5.23
SDA: R4.1 U4.2 U5.24
SWCK: H3.2 U4.19
SWIO: H3.1 U4.18
T+: SW8.1 SW8.2 U4.20
TX: U4.10
$1I4906/$1N310: R5.1 U1.18
$1I4930/$1N310: R1.1 U2.18
$1I4954/$1N310: R6.1 U3.18
$1I4978/$1N310: R11.1 U8.18
$1I5079/$1N310: R12.1 U9.18
$1I5103/$1N310: R13.1 U10.18
$1I5127/$1N310: R14.1 U11.18
$1I5151/$1N310: R15.1 U12.18
$1N1674: LED1.2 R2.2
$1N1867: C1.2 U5.10
$1N1873: C3.1 U5.20
$1N1882: C4.1 U6.4
$1N1924: R7.2 U7.2
$1N1925: LED4.2 R8.2
$1N1926: LED5.2 R9.2
$1N1927: LED4.1 U7.6
$1N1928: LED5.1 U7.7
$1N1929: C7.2 R8.1 R9.1 U7.4 U7.8 USB1.1
$1N1933: Q1.1 R10.2
$1N1934: BUZZER1.2 Q1.3
$1N5059: U3.24 U8.1
$1N5073: U1.24 U2.1
$1N5078: U2.24 U3.1
$1N5217: U11.24 U12.1
$1N5228: U9.24 U10.1
$1N5230: U10.24 U11.1

Pads without a net: SW5 3 4 5 6 7; TP1 1; TP2 1; TP3 1; TP4 1; U4 3 6 13 17; U5 2 3 4 5 6 7 12 14 15 16 17 19 21 22 25; U7 9; USB1 2 3 4 6 7 8 9

## Via types
v1: diameter 0.61, hole 0.305, Top Layer to Bottom Layer, 132 vias

## Routing (per net, layer and track width the routed paths; a pad name or vN(x,y) marks a point on that pad's centre or on a via; arc(x,y) is an arc through that point)
3.3V: length 198.1
  Top Layer w0.254: C9.2 49.3,112.3 U5.8 ; C9.2 51.6,110 53.6,110 ; C9.2 49.2,110.8 v1(49.2,110.5) ; v1(49.2,108.5) 49.2,106.9 48.68,106.38 U4.4 ; 53.6,110 53,110.6 53,114.5 52.4,115.1 51.6,115.1 C2.1 48.75,115.05 U5.13 47.1,115.06 47.1,115.8 46.4,116.5 39.2,116.5 38.7,116 38.7,114.65 R3.2 R4.2 ; 53.6,110 56.8,110 58.7,108.1 58.7,89.3 33.4,64 33.4,60.3 57.3,36.4 57.3,30.3 33.4,6.4 18.38,6.4 U6.5 15.88,8.9 R2.1
  Bottom Layer w0.254: v1(49.2,110.5) v1(49.2,108.5)
5V: length 309.6
  Top Layer w0.254: BUZZER1.1 12.79,108.39 20.8,108.39 R5.2 21.92,109.05 23.53,107.44 24.16,107.44 24.4,107.21 ; U3.19 38.26,93.34 37.63,93.34 36.02,94.95 R6.2 34.9,94.29 ; 20.8,80.19 R11.2 21.92,80.85 23.53,79.24 24.16,79.24 U8.19 ; 34.9,37.89 R14.2 36.02,38.55 37.63,36.94 38.26,36.94 U11.19 ; v1(12.7,32.8) 12.7,34.31 U10.19 10.06,36.94 9.43,36.94 7.82,38.55 R13.2 6.7,37.89 ; U2.19 10.06,93.34 9.43,93.34 7.82,94.95 R1.2 6.7,94.29 ; 20.8,23.79 R15.2 21.92,24.45 23.53,22.84 24.16,22.84 U12.19 26.7,20.31 v1(26.7,18.9) ; 24.81,50.4 24.16,51.04 23.53,51.04 21.92,52.65 R12.2 20.8,51.99 ; U1.19 24.5,107.11
  Top Layer w0.35: v1(12.6,88.4) 12.6,90.81 U2.19 ; U3.19 40.3,91.31 v1(40.3,88.6) ; U9.19 24.81,50.4 v1(24.8,50.4) ; 8.45,24.25 SW5.1 ; 8.45,24.25 6.8,25.9 ; 8.45,24.25 19.7,13 ; 19.7,13 v1(20.6,13.9) ; 19.7,13 19.7,11.78 U6.3 18.15,10.65 17.5,10 17.5,9.15 17.9,8.75 U6.1 ; U11.19 39.47,35.73 40.8,34.4 40.8,33 v1(40,32.2) ; 6.8,25.9 v1(6.8,27) ; 6.8,25.9 3.2,29.5 3.2,36.6 26.9,60.3 26.9,64 v1(21.4,69.5) 9.5,81.4 v1(9.5,81.5) ; v1(26.4,74.5) 26.4,77.01 U8.19 ; 24.4,107.21 24.5,107.11 v1(24.5,107.1)
  Bottom Layer w0.254: 12.64,32.84 12.69,32.8 v1(12.7,32.8)
  Bottom Layer w0.35: v1(20.6,13.9) 21.7,13.9 v1(26.7,18.9) v1(40,32.2) ; v1(24.5,107.1) 16.1,98.7 16.1,91.9 v1(12.6,88.4) 9.5,85.3 v1(9.5,81.5) ; v1(24.8,50.4) 15.8,41.4 15.8,36 v1(6.8,27) ; v1(21.4,69.5) 21.4,69.4 26.4,74.4 v1(26.4,74.5) 40.3,88.4 v1(40.3,88.6)
GND: length 3.9
  Top Layer w0.254: U5.9 v1(50.8,112.8) ; U5.11 48.4,113.8 v1(48.7,114.1)
  vias: v1(12.8,85.1) v1(12.9,28.7) v1(14.2,84.9) v1(14.4,28.4) v1(16.8,21.1) v1(17.5,77.1) v1(17.6,35.7) v1(17.8,49.4) v1(18,91.6) v1(18.4,21.6) v1(18.5,78.1) v1(18.7,34.5) v1(18.8,50.1) v1(19.3,90.3) v1(26.1,71.3) v1(26.4,42.9) v1(26.6,99.2) v1(26.7,14.7) v1(27.5,14.7) v1(27.6,99.4) v1(27.6,42.9) v1(28.9,70.6) v1(31,50.4) v1(31.2,90.9) v1(31.5,106.2) v1(31.5,78) v1(31.5,34.6) v1(32.1,21.1) v1(32.4,49) v1(32.5,35.6) v1(32.6,105.2) v1(32.6,92.1) v1(32.93,20.17) v1(33.8,75.4) v1(40.7,85.2) v1(40.8,110.6) v1(40.81,28.8) v1(41.8,85.2) v1(42.2,28.8) v1(43.04,8.03) v1(43.04,6.85) v1(43.5,115.5) v1(44,9.9) v1(45.6,92.2) v1(45.6,35.7) v1(46,105.7) v1(46.95,34.27) v1(47.11,90.67) v1(54.03,113.22)
$1I4906/NET1: length 13.1
  Top Layer w0.254: NOREF.9 20.11,103.42 23.8,99.72 24.7,99.72 28.52,95.9
$1I4906/NET2: length 19
  Top Layer w0.254: 27.35,112.25 27.13,112.48 27.13,113.82 28.65,115.35 29.55,115.35 32.42,112.47 32.42,108.16 36.6,103.98
$1I4906/NET3: length 8.7
  Top Layer w0.254: v1(32.87,98.01) 32.87,98.73 32.12,99.49
  Bottom Layer w0.254: v1(32.87,98.01) 32.69,98.01 29.01,94.33 29.01,92.91 NOREF.8
$1I4906/NET4: length 12.7
  Top Layer w0.254: NOREF.12 23.81,108.69 26.95,105.56 27.84,105.56 33.01,100.39
$1I4906/NET5: length 21.1
  Top Layer w0.254: NOREF.1 41.49,102.86 31.98,93.34 30.54,93.34 29.82,94.06 29.82,96.4 29.42,96.8
$1I4906/NET6: length 12.9
  Top Layer w0.254: 30.88,94.58 30.91,94.6 32.69,94.6 37.36,99.27 37.36,100.53 36.82,101.07 36.82,101.97 35.71,103.08
$1I4906/NET7: length 10.6
  Top Layer w0.254: v1(31.17,98.64) 31.22,98.59
  Bottom Layer w0.254: NOREF.2 35.94,103.42 v1(31.17,98.64)
$1I4906/NET8: length 3.4
  Top Layer w0.254: NOREF.5 34.42,100.78 33.91,101.29
$1I4906/NET9: length 12.4
  Top Layer w0.254: 37.96,101.65 30.81,108.8 30.81,109.78 U1.14
$1I4906/NET10: length 12.4
  Top Layer w0.254: NOREF.4 29.55,106.52 29.55,107.44 U1.16
$1I4906/NET11: length 8
  Top Layer w0.254: 24.47,105.34 23.35,106.46 23.35,107.11 22.22,108.25 21.87,108.25 20.21,106.59 20.21,105.25 NOREF.10
$1I4906/NET12: length 13.5
  Top Layer w0.254: U1.23 24.16,100.26 28.65,100.26 32.57,96.34 32.65,96.34
$1I4906/NET13: length 3.1
  Top Layer w0.254: U1.21 22.04,105.97 22.04,106.95
$1I4906/NET14: length 4.8
  Top Layer w0.254: 28.96,109.83 28.29,110.5 28.29,111.57 29.12,112.4 NOREF.15
$1I4906/NET15: length 12.2
  Top Layer w0.254: U1.17 26.41,108.79 26.41,109.69 26.95,110.23 26.95,110.95 25.96,111.93 25.96,113.37 28.38,115.79 NOREF.16
$1I4906/NET16: length 8.1
  Bottom Layer w0.254: NOREF.13 25.58,106.44 v1(22.68,103.54)
$1I4930/NET1: length 13.1
  Top Layer w0.254: 14.42,81.8 10.6,85.62 9.7,85.62 6.01,89.32 NOREF#2.9
$1I4930/NET2: length 19
  Top Layer w0.254: 22.5,89.88 18.32,94.06 18.32,98.37 15.45,101.25 14.55,101.25 13.03,99.72 13.03,98.38 13.25,98.16
$1I4930/NET3: length 8.7
  Top Layer w0.254: v1(18.77,83.91) 18.77,84.63 18.01,85.39
  Bottom Layer w0.254: v1(18.77,83.91) 18.59,83.91 14.91,80.23 14.91,78.81 NOREF#2.8
$1I4930/NET4: length 12.7
  Top Layer w0.254: NOREF#2.12 9.71,94.59 12.85,91.46 13.74,91.46 18.91,86.29
$1I4930/NET5: length 21.1
  Top Layer w0.254: NOREF#2.1 27.39,88.76 17.88,79.24 16.44,79.24 15.72,79.96 15.72,82.3 15.32,82.7
$1I4930/NET6: length 12.9
  Top Layer w0.254: 16.78,80.48 16.81,80.5 18.59,80.5 23.26,85.17 23.26,86.43 22.72,86.97 22.72,87.86 21.61,88.98
$1I4930/NET7: length 10.6
  Top Layer w0.254: v1(17.07,84.54) 17.12,84.49
  Bottom Layer w0.254: NOREF#2.2 21.84,89.32 v1(17.07,84.54)
$1I4930/NET8: length 3.4
  Top Layer w0.254: 19.81,87.19 20.32,86.68 NOREF#2.5
$1I4930/NET9: length 12.4
  Top Layer w0.254: U2.14 16.71,95.68 16.71,94.69 23.85,87.55
$1I4930/NET10: length 12.4
  Top Layer w0.254: NOREF#2.4 15.45,92.42 15.45,93.34 U2.16
$1I4930/NET11: length 8
  Top Layer w0.254: 10.37,91.24 9.25,92.36 9.25,93.01 8.12,94.14 7.77,94.14 6.11,92.49 6.11,91.15 6.18,91.08
$1I4930/NET12: length 13.5
  Top Layer w0.254: 18.55,82.25 18.47,82.25 14.55,86.16 10.06,86.16 U2.23
$1I4930/NET13: length 3.1
  Top Layer w0.254: 7.94,92.85 7.94,91.87 U2.21
$1I4930/NET14: length 4.8
  Top Layer w0.254: NOREF#2.15 15.02,98.3 14.19,97.47 14.19,96.4 14.86,95.73
$1I4930/NET15: length 12.2
  Top Layer w0.254: U2.17 12.31,94.69 12.31,95.59 12.85,96.13 12.85,96.85 11.86,97.83 11.86,99.27 14.28,101.69 NOREF#2.16
$1I4930/NET16: length 8.1
  Bottom Layer w0.254: v1(8.58,89.44) 11.48,92.34 NOREF#2.13
$1I4954/NET1: length 13.1
  Top Layer w0.254: NOREF#3.9 34.21,89.32 37.9,85.62 38.8,85.62 42.62,81.8
$1I4954/NET2: length 19.6
  Top Layer w0.254: 50.71,89.88 46.52,94.06 46.52,94.98 43.6,97.9 43.6,98.8 44.31,99.51 44.31,100.58 43.65,101.25 42.75,101.25 41.23,99.72 41.23,98.38 41.45,98.16
$1I4954/NET3: length 8.7
  Top Layer w0.254: 46.22,85.39 46.97,84.63 v1(46.97,83.91)
  Bottom Layer w0.254: NOREF#3.8 43.11,78.81 43.11,80.23 46.79,83.91 v1(46.97,83.91)
$1I4954/NET4: length 12.7
  Top Layer w0.254: NOREF#3.12 37.91,94.59 41.05,91.46 41.94,91.46 47.11,86.29
$1I4954/NET5: length 21.1
  Top Layer w0.254: 43.52,82.7 43.92,82.3 43.92,79.96 44.64,79.24 46.08,79.24 55.59,88.76 NOREF#3.1
$1I4954/NET6: length 12.9
  Top Layer w0.254: 44.98,80.48 45.01,80.5 46.79,80.5 51.46,85.17 51.46,86.43 50.93,86.97 50.93,87.86 49.81,88.98
$1I4954/NET7: length 10.6
  Top Layer w0.254: v1(45.27,84.54) 45.32,84.49
  Bottom Layer w0.254: 53.82,89.32 50.04,89.32 v1(45.27,84.54)
$1I4954/NET8: length 3.4
  Top Layer w0.254: NOREF#3.5 48.52,86.68 48.01,87.19
$1I4954/NET9: length 12.4
  Top Layer w0.254: 52.06,87.55 44.91,94.69 44.91,95.68 U3.14
$1I4954/NET10: length 12.4
  Top Layer w0.254: NOREF#3.4 43.65,92.42 43.65,93.34 U3.16
$1I4954/NET11: length 8
  Top Layer w0.254: 38.57,91.24 37.45,92.36 37.45,93.01 36.32,94.14 35.97,94.14 34.31,92.49 34.31,91.15 NOREF#3.10
$1I4954/NET12: length 13.5
  Top Layer w0.254: 46.75,82.25 46.67,82.25 42.75,86.16 38.26,86.16 U3.23
$1I4954/NET13: length 3.1
  Top Layer w0.254: U3.21 36.15,91.87 36.15,92.85
$1I4954/NET14: length 4.8
  Top Layer w0.254: NOREF#3.15 43.22,98.3 42.39,97.47 42.39,96.4 43.06,95.73
$1I4954/NET15: length 12.2
  Top Layer w0.254: U3.17 40.51,94.69 40.51,95.59 41.05,96.13 41.05,96.85 40.06,97.83 40.06,99.27 42.48,101.69 NOREF#3.16
$1I4954/NET16: length 8.1
  Bottom Layer w0.254: NOREF#3.13 39.68,92.34 v1(36.78,89.44)
$1I4978/NET1: length 13.1
  Top Layer w0.254: 28.52,67.7 24.7,71.52 23.8,71.52 20.11,75.22 NOREF#4.9
$1I4978/NET2: length 19
  Top Layer w0.254: 36.6,75.78 32.42,79.96 32.42,84.27 29.55,87.15 28.65,87.15 27.13,85.62 27.13,84.28 27.35,84.06
$1I4978/NET3: length 8.7
  Top Layer w0.254: v1(32.87,69.81) 32.87,70.53 32.12,71.29
  Bottom Layer w0.254: v1(32.87,69.81) 32.69,69.81 29.01,66.13 29.01,64.71 NOREF#4.8
$1I4978/NET4: length 12.7
  Top Layer w0.254: NOREF#4.12 23.81,80.49 26.95,77.36 27.84,77.36 33.01,72.19
$1I4978/NET5: length 21.1
  Top Layer w0.254: 29.42,68.6 29.82,68.2 29.82,65.86 30.54,65.14 31.98,65.14 41.49,74.66 NOREF#4.1
$1I4978/NET6: length 12.9
  Top Layer w0.254: 35.71,74.88 36.82,73.77 36.82,72.87 37.36,72.33 37.36,71.07 32.69,66.4 30.91,66.4 30.88,66.38
$1I4978/NET7: length 10.6
  Top Layer w0.254: v1(31.17,70.44) 31.22,70.39
  Bottom Layer w0.254: v1(31.17,70.44) 35.94,75.22 NOREF#4.2
$1I4978/NET8: length 3.4
  Top Layer w0.254: NOREF#4.5 34.42,72.58 33.91,73.09
$1I4978/NET9: length 12.4
  Top Layer w0.254: U8.14 30.81,81.58 30.81,80.59 37.96,73.45
$1I4978/NET10: length 12.4
  Top Layer w0.254: NOREF#4.4 29.55,78.32 29.55,79.24 U8.16
$1I4978/NET11: length 8
  Top Layer w0.254: 24.47,77.14 23.35,78.26 23.35,78.91 22.22,80.05 21.87,80.05 20.21,78.39 20.21,77.05 NOREF#4.10
$1I4978/NET12: length 13.5
  Top Layer w0.254: U8.23 24.16,72.06 28.65,72.06 32.57,68.14 32.65,68.14
$1I4978/NET13: length 3.1
  Top Layer w0.254: 22.04,78.75 22.04,77.77 U8.21
$1I4978/NET14: length 4.8
  Top Layer w0.254: NOREF#4.15 29.12,84.2 28.29,83.37 28.29,82.3 28.96,81.63
$1I4978/NET15: length 12.2
  Top Layer w0.254: NOREF#4.16 28.38,87.59 25.96,85.17 25.96,83.73 26.95,82.75 26.95,82.03 26.41,81.49 26.41,80.59 U8.17
$1I4978/NET16: length 8.1
  Bottom Layer w0.254: v1(22.68,75.34) 25.58,78.25 NOREF#4.13
$1I5079/NET1: length 13.1
  Top Layer w0.254: NOREF#5.9 20.11,47.02 23.8,43.32 24.7,43.32 28.52,39.5
$1I5079/NET2: length 19
  Top Layer w0.254: 36.6,47.58 32.42,51.76 32.42,56.07 29.55,58.95 28.65,58.95 27.13,57.42 27.13,56.08 27.35,55.86
$1I5079/NET3: length 8.7
  Top Layer w0.254: 32.12,43.09 32.87,42.33 v1(32.87,41.61)
  Bottom Layer w0.254: NOREF#5.8 29.01,36.51 29.01,37.93 32.69,41.61 v1(32.87,41.61)
$1I5079/NET4: length 12.7
  Top Layer w0.254: 33.01,43.99 27.84,49.16 26.95,49.16 23.81,52.29 NOREF#5.12
$1I5079/NET5: length 21.1
  Top Layer w0.254: NOREF#5.1 41.49,46.46 31.98,36.94 30.54,36.94 29.82,37.66 29.82,40 29.42,40.4
$1I5079/NET6: length 12.9
  Top Layer w0.254: 35.71,46.68 36.82,45.56 36.82,44.67 37.36,44.13 37.36,42.87 32.69,38.2 30.91,38.2 30.88,38.18
$1I5079/NET7: length 10.6
  Top Layer w0.254: v1(31.17,42.24) 31.22,42.19
  Bottom Layer w0.254: NOREF#5.2 35.94,47.02 v1(31.17,42.24)
$1I5079/NET8: length 3.4
  Top Layer w0.254: NOREF#5.5 34.42,44.38 33.91,44.89
$1I5079/NET9: length 12.4
  Top Layer w0.254: 37.96,45.25 30.81,52.39 30.81,53.38 U9.14
$1I5079/NET10: length 12.4
  Top Layer w0.254: U9.16 29.55,51.04 29.55,50.12 NOREF#5.4
$1I5079/NET11: length 8
  Top Layer w0.254: NOREF#5.10 20.21,48.85 20.21,50.19 21.87,51.84 22.22,51.84 23.35,50.71 23.35,50.06 24.47,48.94
$1I5079/NET12: length 13.5
  Top Layer w0.254: 32.65,39.94 32.57,39.94 28.65,43.86 24.16,43.86 U9.23
$1I5079/NET13: length 3.1
  Top Layer w0.254: 22.04,50.55 22.04,49.57 U9.21
$1I5079/NET14: length 4.8
  Top Layer w0.254: NOREF#5.15 29.12,56 28.29,55.17 28.29,54.1 28.96,53.43
$1I5079/NET15: length 12.2
  Top Layer w0.254: U9.17 26.41,52.39 26.41,53.29 26.95,53.83 26.95,54.55 25.96,55.53 25.96,56.97 28.38,59.39 NOREF#5.16
$1I5079/NET16: length 8.1
  Bottom Layer w0.254: NOREF#5.13 25.58,50.05 v1(22.68,47.14)
$1I5103/NET1: length 13.1
  Top Layer w0.254: 14.42,25.4 10.6,29.22 9.7,29.22 6.01,32.92 NOREF#6.9
$1I5103/NET2: length 19
  Top Layer w0.254: 13.25,41.75 13.03,41.98 13.03,43.32 14.55,44.85 15.45,44.85 18.32,41.97 18.32,37.66 22.5,33.48
$1I5103/NET3: length 8.7
  Top Layer w0.254: v1(18.77,27.51) 18.77,28.23 18.01,28.99
  Bottom Layer w0.254: v1(18.77,27.51) 18.59,27.51 14.91,23.83 14.91,22.41 NOREF#6.8
$1I5103/NET4: length 12.7
  Top Layer w0.254: NOREF#6.12 9.71,38.19 12.85,35.06 13.74,35.06 18.91,29.89
$1I5103/NET5: length 21.1
  Top Layer w0.254: 15.32,26.3 15.72,25.9 15.72,23.56 16.44,22.84 17.88,22.84 27.39,32.36 NOREF#6.1
$1I5103/NET6: length 12.9
  Top Layer w0.254: 21.61,32.58 22.72,31.47 22.72,30.57 23.26,30.03 23.26,28.77 18.59,24.1 16.81,24.1 16.78,24.08
$1I5103/NET7: length 10.6
  Top Layer w0.254: v1(17.07,28.14) 17.12,28.09
  Bottom Layer w0.254: v1(17.07,28.14) 21.84,32.92 NOREF#6.2
$1I5103/NET8: length 3.4
  Top Layer w0.254: NOREF#6.5 20.32,30.28 19.81,30.79
$1I5103/NET9: length 12.4
  Top Layer w0.254: U10.14 16.71,39.28 16.71,38.29 23.85,31.15
$1I5103/NET10: length 12.4
  Top Layer w0.254: U10.16 15.45,36.94 15.45,36.02 NOREF#6.4
$1I5103/NET11: length 8
  Top Layer w0.254: 10.37,34.84 9.25,35.96 9.25,36.61 8.12,37.75 7.77,37.75 6.11,36.09 6.11,34.75 6.18,34.68
$1I5103/NET12: length 13.5
  Top Layer w0.254: U10.23 10.06,29.76 14.55,29.76 18.47,25.84 18.55,25.84
$1I5103/NET13: length 3.1
  Top Layer w0.254: U10.21 7.94,35.47 7.94,36.45
$1I5103/NET14: length 4.8
  Top Layer w0.254: 14.86,39.33 14.19,40 14.19,41.07 15.02,41.9 NOREF#6.15
$1I5103/NET15: length 12.2
  Top Layer w0.254: NOREF#6.16 14.28,45.29 11.86,42.87 11.86,41.43 12.85,40.45 12.85,39.73 12.31,39.19 12.31,38.29 U10.17
$1I5103/NET16: length 8.1
  Bottom Layer w0.254: NOREF#6.13 11.48,35.94 v1(8.58,33.04)
$1I5127/NET1: length 13.1
  Top Layer w0.254: NOREF#7.9 34.21,32.92 37.9,29.22 38.8,29.22 42.62,25.4
$1I5127/NET2: length 19
  Top Layer w0.254: 41.45,41.75 41.23,41.98 41.23,43.32 42.75,44.85 43.65,44.85 46.52,41.97 46.52,37.66 50.71,33.48
$1I5127/NET3: length 8.7
  Top Layer w0.254: v1(46.97,27.51) 46.97,28.23 46.22,28.99
  Bottom Layer w0.254: NOREF#7.8 43.11,22.41 43.11,23.83 46.79,27.51 v1(46.97,27.51)
$1I5127/NET4: length 12.7
  Top Layer w0.254: 47.11,29.89 41.94,35.06 41.05,35.06 37.91,38.19 NOREF#7.12
$1I5127/NET5: length 21.1
  Top Layer w0.254: NOREF#7.1 55.59,32.36 46.08,22.84 44.64,22.84 43.92,23.56 43.92,25.9 43.52,26.3
$1I5127/NET6: length 12.9
  Top Layer w0.254: 44.98,24.08 45.01,24.1 46.79,24.1 51.46,28.77 51.46,30.03 50.93,30.57 50.93,31.47 49.81,32.58
$1I5127/NET7: length 10.6
  Top Layer w0.254: v1(45.27,28.14) 45.32,28.09
  Bottom Layer w0.254: 53.82,32.92 50.04,32.92 v1(45.27,28.14)
$1I5127/NET8: length 3.4
  Top Layer w0.254: NOREF#7.5 48.52,30.28 48.01,30.79
$1I5127/NET9: length 12.4
  Top Layer w0.254: U11.14 44.91,39.28 44.91,38.29 52.06,31.15
$1I5127/NET10: length 12.4
  Top Layer w0.254: U11.16 43.65,36.94 43.65,36.02 NOREF#7.4
$1I5127/NET11: length 8
  Top Layer w0.254: NOREF#7.10 34.31,34.75 34.31,36.09 35.97,37.75 36.32,37.75 37.45,36.61 37.45,35.96 38.57,34.84
$1I5127/NET12: length 13.5
  Top Layer w0.254: U11.23 38.26,29.76 42.75,29.76 46.67,25.84 46.75,25.84
$1I5127/NET13: length 3.1
  Top Layer w0.254: U11.21 36.15,35.47 36.15,36.45
$1I5127/NET14: length 4.8
  Top Layer w0.254: NOREF#7.15 43.22,41.9 42.39,41.07 42.39,40 43.06,39.33
$1I5127/NET15: length 12.2
  Top Layer w0.254: U11.17 40.51,38.29 40.51,39.19 41.05,39.73 41.05,40.45 40.06,41.43 40.06,42.87 42.48,45.29 NOREF#7.16
$1I5127/NET16: length 8.1
  Bottom Layer w0.254: NOREF#7.13 39.68,35.94 v1(36.78,33.04)
$1I5151/NET1: length 13.1
  Top Layer w0.254: NOREF#8.9 20.11,18.82 23.8,15.12 24.7,15.12 28.52,11.3
$1I5151/NET2: length 19
  Top Layer w0.254: 36.6,19.38 32.42,23.56 32.42,27.87 29.55,30.75 28.65,30.75 27.13,29.22 27.13,27.88 27.35,27.66
$1I5151/NET3: length 8.7
  Top Layer w0.254: v1(32.87,13.41) 32.87,14.13 32.12,14.89
  Bottom Layer w0.254: NOREF#8.8 29.01,8.31 29.01,9.73 32.69,13.41 v1(32.87,13.41)
$1I5151/NET4: length 12.7
  Top Layer w0.254: NOREF#8.12 23.81,24.09 26.95,20.96 27.84,20.96 33.01,15.79
$1I5151/NET5: length 21.1
  Top Layer w0.254: 29.42,12.2 29.82,11.8 29.82,9.46 30.54,8.74 31.98,8.74 41.49,18.26 NOREF#8.1
$1I5151/NET6: length 12.9
  Top Layer w0.254: 35.71,18.48 36.82,17.37 36.82,16.47 37.36,15.93 37.36,14.67 32.69,10 30.91,10 30.88,9.98
$1I5151/NET7: length 10.6
  Top Layer w0.254: v1(31.17,14.04) 31.22,13.99
  Bottom Layer w0.254: v1(31.17,14.04) 35.94,18.82 NOREF#8.2
$1I5151/NET8: length 3.4
  Top Layer w0.254: 33.91,16.69 34.42,16.18 NOREF#8.5
$1I5151/NET9: length 12.4
  Top Layer w0.254: 37.96,17.05 30.81,24.19 30.81,25.18 U12.14
$1I5151/NET10: length 12.4
  Top Layer w0.254: U12.16 29.55,22.84 29.55,21.92 NOREF#8.4
$1I5151/NET11: length 8
  Top Layer w0.254: NOREF#8.10 20.21,20.65 20.21,21.99 21.87,23.65 22.22,23.65 23.35,22.51 23.35,21.85 24.47,20.74
$1I5151/NET12: length 13.5
  Top Layer w0.254: 32.65,11.75 32.57,11.75 28.65,15.66 24.16,15.66 U12.23
$1I5151/NET13: length 3.1
  Top Layer w0.254: 22.04,22.35 22.04,21.37 U12.21
$1I5151/NET14: length 4.8
  Top Layer w0.254: NOREF#8.15 29.12,27.8 28.29,26.97 28.29,25.9 28.96,25.23
$1I5151/NET15: length 12.2
  Top Layer w0.254: NOREF#8.16 28.38,31.19 25.96,28.77 25.96,27.33 26.95,26.35 26.95,25.63 26.41,25.09 26.41,24.19 U12.17
$1I5151/NET16: length 8.1
  Bottom Layer w0.254: v1(22.68,18.94) 25.58,21.84 NOREF#8.13
BAT: length 63.7
  Top Layer w0.35: SW5.2 3.94,21 5.1,21 8.8,17.3 8.8,8.6 12.8,4.6 38.3,4.6 39.31,5.61 U7.5 ; 40.08,5.7 40.08,7.59 C8.2 48.1,15.61 H2.1
BEEP: length 36
  Top Layer w0.254: v1(25.1,113.7) 22.6,113.7 22.5,113.8 ; v1(50.4,105.6) 50.93,105.08 U4.15
  Bottom Layer w0.254: v1(25.1,113.7) 26.8,115.4 29.6,115.4 37.9,107.1 48.9,107.1 v1(50.4,105.6)
CLK: length 203.7
  Top Layer w0.254: 30.76,27.02 v1(30.76,28.5) ; v1(17.6,98) 17.14,98 16.66,97.52 ; v1(29.5,60.5) 29.5,61.9 57.5,89.9 57.5,99.19 54.89,101.81 54.89,102.51 54.28,103.12 U4.12 v1(50.8,103.12) ; 30.76,55.22 30.7,55.28 v1(30.7,56.7) ; v1(45.7,39.3) 45.7,40.28 44.86,41.12 ; v1(17.5,41.6) 17.02,41.12 16.66,41.12 ; v1(31.7,83.7) 31.04,83.7 30.76,83.42 ; v1(31.6,109.7) 31.6,110.78 30.76,111.62 ; v1(45.6,97.9) 45.22,97.52 44.86,97.52
  Bottom Layer w0.254: v1(30.76,28.5) 30.76,29.54 ; 30.76,29.54 31.9,28.4 34.8,28.4 v1(45.7,39.3) ; 30.76,29.54 18.83,41.47 18.83,42.23 ; 18.83,42.23 18.2,41.6 v1(17.5,41.6) ; 18.83,42.23 30.3,53.7 30.3,58.15 30.32,58.18 ; v1(30.7,56.7) 30.7,57.8 30.32,58.18 ; v1(31.6,109.7) 19.9,98 18.7,98 ; 30.32,58.18 29.5,59 v1(29.5,60.5) ; v1(50.8,103.12) 46.34,98.66 ; 46.34,98.66 46.34,97.54 33.35,84.55 ; 46.34,98.66 45.6,97.92 v1(45.6,97.9) ; 33.35,84.55 32.5,83.7 v1(31.7,83.7) ; 33.35,84.55 32.15,84.55 18.7,98 ; 18.7,98 v1(17.6,98)
CS1: length 77.5
  Top Layer w0.254: v1(23.8,94.4) 23.4,94 23.4,90.78 ; 37.5,76.68 36.7,77.48 v1(36.7,78.8) ; v1(49.8,91.9) 50.48,91.9 51.6,90.78 53.47,92.65 U4.11 52.9,101.9 46.9,101.9 42.1,106.7 39.32,106.7 37.5,104.88 36.28,106.1 v1(35.6,106.1)
  Bottom Layer w0.254: v1(35.6,106.1) 23.9,94.4 v1(23.8,94.4) ; v1(36.7,78.8) v1(49.8,91.9)
CS2: length 140.1
  Top Layer w0.254: 37.5,52.04 37.5,55.6 32.8,60.3 32.8,64 58.3,89.5 58.3,99.4 55.6,102.1 55.6,104.59 54.47,105.72 53.47,105.72 ; 37.5,52.04 37.76,52.29 39.61,52.29 51.6,40.3 51.6,34.38 50.78,35.2 v1(50,35.2) ; 37.5,52.04 37.5,48.48 ; v1(25.4,37.6) 23.4,35.6 23.4,34.38 ; v1(37.2,21.9) 37.2,20.58 37.5,20.28
  Bottom Layer w0.254: v1(37,49) 25.7,37.7 25.5,37.7 v1(25.4,37.6) ; v1(37.2,21.9) 37.2,22.4 v1(50,35.2)
DIN: length 118.2
  Top Layer w0.254: v1(36.8,50.5) 36.8,55.5 32.2,60.1 32.2,64 57.9,89.7 57.9,99.3 55.24,101.95 55.24,104.06 54.88,104.42 v1(50.5,104.42) ; 27.62,38.6 27,39.23 v1(27,40) ; 27.62,95 27.4,95.23 v1(27.4,95.3)
  Bottom Layer w0.254: v1(36.8,50.5) 27,40.7 v1(27,40) ; v1(27.4,95.3) 27.4,96.5 37.6,106.7 48.22,106.7 v1(50.5,104.42)
L+: length 41.5
  Top Layer w0.254: 47.73,104.42 45.78,104.42 41.7,108.5 40.2,108.5 31.5,117.2 30.3,117.2 29.5,116.4 22.9,116.4 SW6.1 SW6.2
L-: length 25.6
  Top Layer w0.254: SW7.2 SW7.1 47.65,117.75 v1(47.7,117.7) ; v1(49.8,107.6) 49.8,104.7 48.88,103.78 U4.8
  Bottom Layer w0.254: v1(49.8,107.6) 49.8,115.6 v1(47.7,117.7)
SCL: length 11
  Top Layer w0.254: v1(44.4,108.7) 47.35,108.7 U4.1 ; U5.23 43.2,112.3 v1(42.8,112.7) 42.1,113.4 R3.1
  Bottom Layer w0.254: v1(44.4,108.7) 42.8,110.3 v1(42.8,112.7)
SDA: length 11.1
  Top Layer w0.254: R4.1 v1(42.2,111.8) U5.24 ; U4.2 43.82,107.67 v1(42.8,108.7)
  Bottom Layer w0.254: v1(42.8,108.7) 42.2,109.3 v1(42.2,111.8)
SWCK: length 6
  Top Layer w0.254: U4.19 55.07,107.67 v1(55.1,107.7)
  Bottom Layer w0.254: H3.2 57.07,104.43 55.9,105.6 55.9,106.9 v1(55.1,107.7)
SWIO: length 3.9
  Top Layer w0.254: U4.18 57.25,107.03 H3.1
T+: length 33.4
  Top Layer w0.254: SW8.2 SW8.1 34.55,115.15 40.06,109.64 52.15,109.64 U4.20
$1I4906/$1N310: length 5.1
  Top Layer w0.254: U1.18 25.06,108.34 25.06,109.06 23.54,110.58 R5.1
$1I4930/$1N310: length 5.1
  Top Layer w0.254: R1.1 9.44,96.48 10.96,94.96 10.96,94.24 U2.18
$1I4954/$1N310: length 5.1
  Top Layer w0.254: R6.1 37.64,96.48 39.16,94.96 39.16,94.24 U3.18
$1I4978/$1N310: length 5.1
  Top Layer w0.254: U8.18 25.06,80.14 25.06,80.86 23.54,82.38 R11.1
$1I5079/$1N310: length 5.1
  Top Layer w0.254: U9.18 25.06,51.94 25.06,52.66 23.54,54.18 R12.1
$1I5103/$1N310: length 5.1
  Top Layer w0.254: U10.18 10.96,37.84 10.96,38.56 9.44,40.08 R13.1
$1I5127/$1N310: length 5.1
  Top Layer w0.254: U11.18 39.16,37.84 39.16,38.56 37.64,40.08 R14.1
$1I5151/$1N310: length 5.1
  Top Layer w0.254: R15.1 23.54,25.98 25.06,24.46 25.06,23.74 26.27,22.53
$1N1674: length 2.1
  Top Layer w0.254: 11.95,10.4 14.04,10.4 14.05,10.41
$1N1867: length 2.5
  Top Layer w0.254: U5.10 49.37,113.3 C1.2
$1N1873: length 3.1
  Top Layer w0.254: U5.20 43.2,113.8 42.01,114.99 C3.1
$1N1882: length 2.2
  Top Layer w0.254: C4.1 16.03,11.74 U6.4
$1N1924: length 1.8
  Top Layer w0.254: U7.2 47.58,3.07 R7.2
$1N1925: length 1.8
  Top Layer w0.254: 34.95,3.26 R8.2
$1N1926: length 1.8
  Top Layer w0.254: R9.2 34.85,1.8 LED5.2
$1N1927: length 4
  Top Layer w0.254: U7.6 39.35,4.34 38.32,3.31 LED4.1
$1N1928: length 4.1
  Top Layer w0.254: U7.7 39.59,3.07 38.23,1.71 LED5.1
$1N1929: length 47.9
  Top Layer w0.35: USB1.1 45.6,11.85 C7.2 ; U7.4 45.6,5.91 C7.2 ; C7.2 46.87,8.03 49,5.9 49,1.6 48.2,0.8 41.08,0.8 U7.8 39.78,1.8 38.78,0.8 32.5,0.8 31.7,1.6 31.7,3.21 31.65,3.26
$1N1933: length 2.8
  Top Layer w0.254: 20.79,113.75 18.92,111.88 Q1.1
$1N1934: length 5.7
  Top Layer w0.254: Q1.3 15.42,111.8 BUZZER1.2
$1N5059: length 27.7
  Top Layer w0.254: 27.62,66.8 26.8,66.8 v1(25.8,67.8) ; 34.98,87.64 33.2,85.86 33.2,80.2 v1(34.7,78.7)
  Bottom Layer w0.254: v1(25.8,67.8) 25.4,68.2 25.4,69.5 34.7,78.8 v1(34.7,78.7)
$1N5073: length 26.1
  Top Layer w0.254: 13.52,80.9 13.4,81.03 v1(13.4,81.1) ; v1(21.6,92.1) 19.1,94.6 19.1,99.96 20.88,101.75
  Bottom Layer w0.254: v1(13.4,81.1) 13.4,82.1 21.6,90.3 v1(21.6,92.1)
$1N5078: length 49
  Top Layer w0.254: 6.78,87.64 6.78,85.32 23.2,68.9 v1(26,68.9) ; v1(37.9,77.6) 41.2,80.9 41.72,80.9
  Bottom Layer w0.254: v1(37.9,77.6) 34.7,77.6 v1(26,68.9)
$1N5217: length 26.5
  Top Layer w0.254: 27.62,10.4 27.23,10.8 v1(26,10.8) ; 34.98,31.25 33.4,29.66 v1(33.4,24)
  Bottom Layer w0.254: v1(33.4,24) 25.3,15.9 25.3,11.5 v1(26,10.8)
$1N5228: length 26.1
  Top Layer w0.254: 13.52,24.5 13,25.03 v1(13,25.1) ; 20.88,45.34 19,43.46 19,38 v1(21.1,35.9)
  Bottom Layer w0.254: v1(21.1,35.9) 21.1,33.2 v1(13,25.1)
$1N5230: length 49.5
  Top Layer w0.254: v1(40.5,23.2) 41.72,24.42 41.72,24.5 ; v1(26.1,12.1) 23.5,12.1 6.78,28.82 6.78,31.25
  Bottom Layer w0.254: v1(26.1,12.1) 35.1,21.1 38.4,21.1 v1(40.5,23.2)

## Copper pours and planes (outline as drawn; the poured copper is in the pictures)
GND on Top Layer: -0.4,124.1 60.5,124.1 60.5,-0.8 -0.4,-0.8
GND on Bottom Layer: -9.6,124.1 68.7,124.1 68.7,-1 -9.6,-1

## Text on the board
Top Silkscreen Layer: JLCJLCJLCJLCJLCJLC
